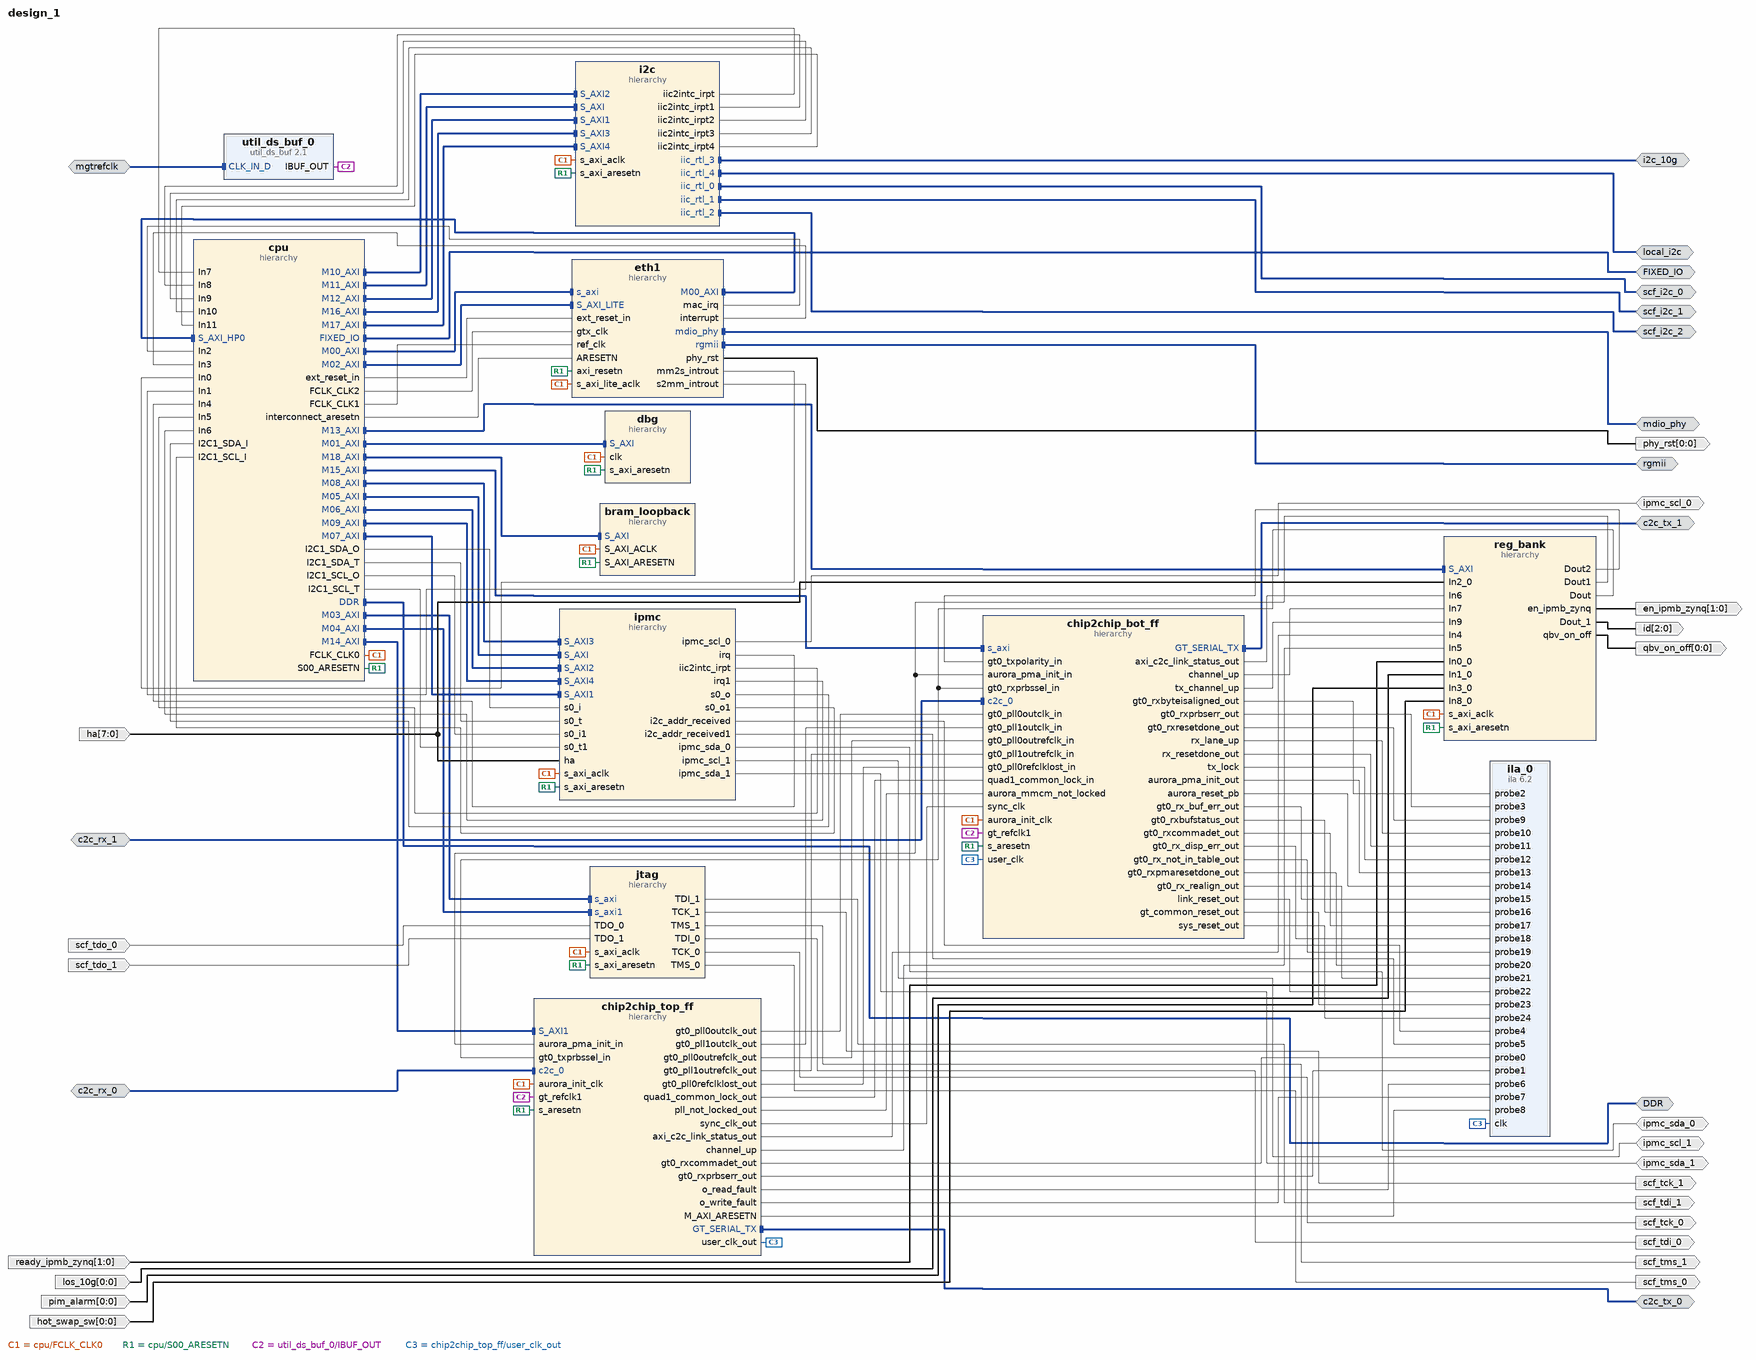
[diagram p0: block diagram of the top level]
# Vivado block design design_1, xc7z015clg485-1, Vivado 2020.1.1_AR73018
create_bd_design design_1

create_bd_intf_port -mode Master -vlnv xilinx.com:interface:ddrx_rtl:1.0 DDR
create_bd_intf_port -mode Master -vlnv xilinx.com:display_processing_system7:fixedio_rtl:1.0 FIXED_IO
create_bd_intf_port -mode Master -vlnv xilinx.com:interface:mdio_rtl:1.0 mdio_phy
create_bd_intf_port -mode Master -vlnv xilinx.com:interface:rgmii_rtl:1.0 rgmii
create_bd_intf_port -mode Master -vlnv xilinx.com:interface:iic_rtl:1.0 scf_i2c_0
create_bd_intf_port -mode Master -vlnv xilinx.com:interface:iic_rtl:1.0 scf_i2c_1
create_bd_intf_port -mode Master -vlnv xilinx.com:interface:iic_rtl:1.0 scf_i2c_2
create_bd_intf_port -mode Master -vlnv xilinx.com:display_aurora:GT_Serial_Transceiver_Pins_TX_rtl:1.0 c2c_tx_0
create_bd_intf_port -mode Slave -vlnv xilinx.com:display_aurora:GT_Serial_Transceiver_Pins_RX_rtl:1.0 c2c_rx_0
create_bd_intf_port -mode Slave -vlnv xilinx.com:interface:diff_clock_rtl:1.0 mgtrefclk
set_property -dict {CONFIG.FREQ_HZ 250000000} [get_bd_intf_ports mgtrefclk]
create_bd_intf_port -mode Master -vlnv xilinx.com:display_aurora:GT_Serial_Transceiver_Pins_TX_rtl:1.0 c2c_tx_1
create_bd_intf_port -mode Slave -vlnv xilinx.com:display_aurora:GT_Serial_Transceiver_Pins_RX_rtl:1.0 c2c_rx_1
create_bd_intf_port -mode Master -vlnv xilinx.com:interface:iic_rtl:1.0 i2c_10g
create_bd_intf_port -mode Master -vlnv xilinx.com:interface:iic_rtl:1.0 local_i2c
create_bd_port -dir O -from 0 -to 0 -type rst phy_rst
set_property -dict {CONFIG.POLARITY ACTIVE_LOW} [get_bd_ports phy_rst]
create_bd_port -dir O scf_tdi_1
create_bd_port -dir O scf_tms_1
create_bd_port -dir O scf_tck_1
create_bd_port -dir I scf_tdo_0
create_bd_port -dir O scf_tdi_0
create_bd_port -dir O scf_tms_0
create_bd_port -dir O scf_tck_0
create_bd_port -dir I scf_tdo_1
create_bd_port -dir IO ipmc_sda_0
create_bd_port -dir IO ipmc_scl_0
create_bd_port -dir IO ipmc_scl_1
create_bd_port -dir IO ipmc_sda_1
create_bd_port -dir O -from 1 -to 0 en_ipmb_zynq
create_bd_port -dir O -from 2 -to 0 id
create_bd_port -dir I -from 1 -to 0 ready_ipmb_zynq
create_bd_port -dir I -from 0 -to 0 los_10g
create_bd_port -dir I -from 7 -to 0 ha
create_bd_port -dir I -from 0 -to 0 pim_alarm
create_bd_port -dir O -from 0 -to 0 qbv_on_off
create_bd_port -dir I -from 0 -to 0 hot_swap_sw

create_bd_cell -type hier eth1
create_bd_cell -type hier jtag
create_bd_cell -type hier ipmc
create_bd_cell -type hier cpu
create_bd_cell -type hier dbg
create_bd_cell -type hier i2c
create_bd_cell -type hier reg_bank
create_bd_cell -type ip -vlnv xilinx.com:ip:util_ds_buf:2.1 util_ds_buf_0
set_property -dict {CONFIG.C_BUF_TYPE IBUFDSGTE} [get_bd_cells util_ds_buf_0]
create_bd_cell -type hier chip2chip_top_ff
create_bd_cell -type hier chip2chip_bot_ff
create_bd_cell -type ip -vlnv xilinx.com:ip:ila:6.2 ila_0
set_property -dict [list \
  CONFIG.C_ENABLE_ILA_AXI_MON false \
  CONFIG.C_MONITOR_TYPE Native \
  CONFIG.C_NUM_OF_PROBES 25 \
  CONFIG.C_PROBE4_WIDTH 7 \
  CONFIG.C_PROBE5_WIDTH 7 \
] [get_bd_cells ila_0]
create_bd_cell -type hier bram_loopback

# ---- hierarchy /eth1 ----
current_bd_instance /eth1
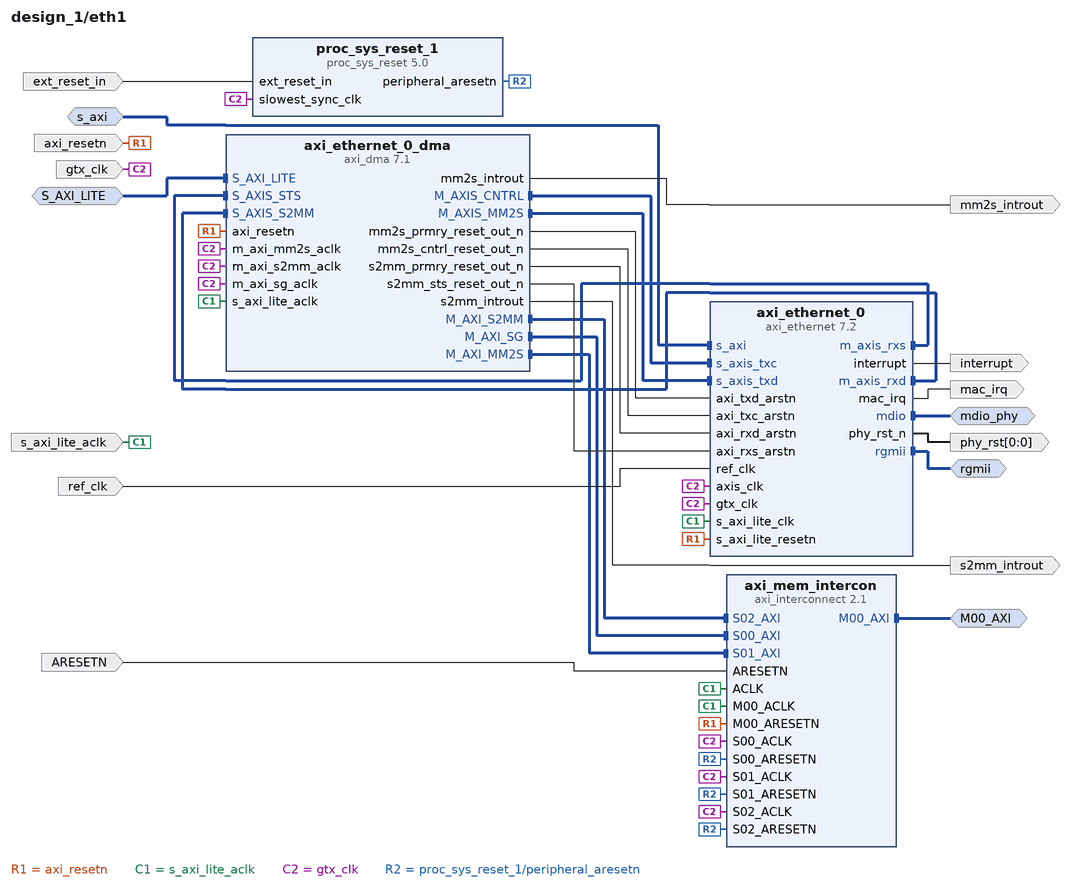
[diagram p1: block diagram inside /eth1]
create_bd_intf_pin -mode Slave -vlnv xilinx.com:interface:aximm_rtl:1.0 s_axi
create_bd_intf_pin -mode Master -vlnv xilinx.com:interface:mdio_rtl:1.0 mdio_phy
create_bd_intf_pin -mode Master -vlnv xilinx.com:interface:rgmii_rtl:1.0 rgmii
create_bd_intf_pin -mode Slave -vlnv xilinx.com:interface:aximm_rtl:1.0 S_AXI_LITE
create_bd_intf_pin -mode Master -vlnv xilinx.com:interface:aximm_rtl:1.0 M00_AXI
create_bd_pin -dir I -type rst axi_resetn
create_bd_pin -dir I -type clk s_axi_lite_aclk
create_bd_pin -dir O -type intr mac_irq
create_bd_pin -dir I -type clk gtx_clk
create_bd_pin -dir O -type intr interrupt
create_bd_pin -dir O -from 0 -to 0 -type rst phy_rst
create_bd_pin -dir I -type clk ref_clk
create_bd_pin -dir O -type intr mm2s_introut
create_bd_pin -dir O -type intr s2mm_introut
create_bd_pin -dir I -type rst ARESETN
create_bd_pin -dir I -type rst ext_reset_in

create_bd_cell -type ip -vlnv xilinx.com:ip:axi_ethernet:7.2 axi_ethernet_0
set_property -dict {CONFIG.PHY_TYPE RGMII} [get_bd_cells axi_ethernet_0]
create_bd_cell -type ip -vlnv xilinx.com:ip:axi_dma:7.1 axi_ethernet_0_dma
set_property -dict [list \
  CONFIG.c_include_mm2s_dre 1 \
  CONFIG.c_include_s2mm_dre 1 \
  CONFIG.c_sg_length_width 16 \
  CONFIG.c_sg_use_stsapp_length 1 \
] [get_bd_cells axi_ethernet_0_dma]
create_bd_cell -type ip -vlnv xilinx.com:ip:axi_interconnect:2.1 axi_mem_intercon
set_property -dict {CONFIG.NUM_MI 1 CONFIG.NUM_SI 3} [get_bd_cells axi_mem_intercon]
create_bd_cell -type ip -vlnv xilinx.com:ip:proc_sys_reset:5.0 proc_sys_reset_1

# ---- hierarchy /jtag ----
current_bd_instance /jtag
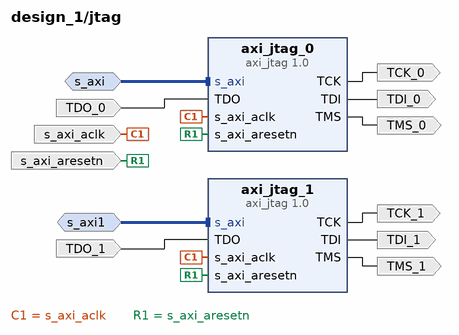
[diagram p2: block diagram inside /jtag]
create_bd_intf_pin -mode Slave -vlnv xilinx.com:interface:aximm_rtl:1.0 s_axi
create_bd_intf_pin -mode Slave -vlnv xilinx.com:interface:aximm_rtl:1.0 s_axi1
create_bd_pin -dir I -type clk s_axi_aclk
create_bd_pin -dir I -type rst s_axi_aresetn
create_bd_pin -dir O TCK_0
create_bd_pin -dir O TMS_0
create_bd_pin -dir O TDI_0
create_bd_pin -dir I TDO_0
create_bd_pin -dir O TCK_1
create_bd_pin -dir O TMS_1
create_bd_pin -dir O TDI_1
create_bd_pin -dir I TDO_1

create_bd_cell -type ip -vlnv A_Clark:Debug:axi_jtag:1.0 axi_jtag_0
create_bd_cell -type ip -vlnv A_Clark:Debug:axi_jtag:1.0 axi_jtag_1

# ---- hierarchy /ipmc ----
current_bd_instance /ipmc
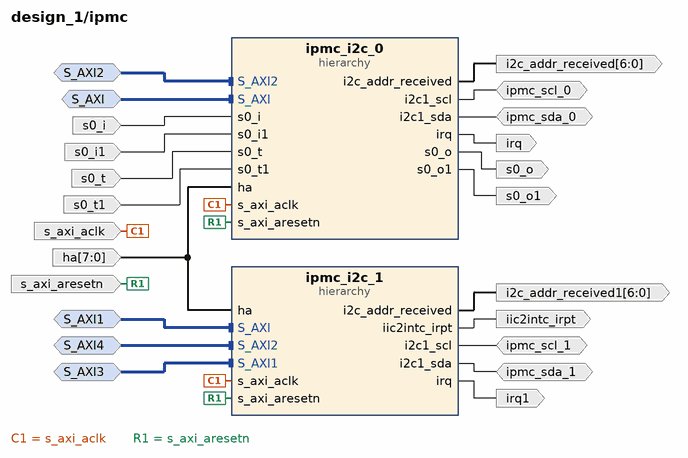
[diagram p3: block diagram inside /ipmc]
create_bd_intf_pin -mode Slave -vlnv xilinx.com:interface:aximm_rtl:1.0 S_AXI
create_bd_intf_pin -mode Slave -vlnv xilinx.com:interface:aximm_rtl:1.0 S_AXI2
create_bd_intf_pin -mode Slave -vlnv xilinx.com:interface:aximm_rtl:1.0 S_AXI1
create_bd_intf_pin -mode Slave -vlnv xilinx.com:interface:aximm_rtl:1.0 S_AXI3
create_bd_intf_pin -mode Slave -vlnv xilinx.com:interface:aximm_rtl:1.0 S_AXI4
create_bd_pin -dir IO ipmc_scl_0
create_bd_pin -dir IO ipmc_sda_0
create_bd_pin -dir O -type intr irq
create_bd_pin -dir I s0_i
create_bd_pin -dir I s0_i1
create_bd_pin -dir O s0_o
create_bd_pin -dir O s0_o1
create_bd_pin -dir I s0_t
create_bd_pin -dir I s0_t1
create_bd_pin -dir I -type clk s_axi_aclk
create_bd_pin -dir I -type rst s_axi_aresetn
create_bd_pin -dir IO ipmc_scl_1
create_bd_pin -dir IO ipmc_sda_1
create_bd_pin -dir O -type intr iic2intc_irpt
create_bd_pin -dir O -type intr irq1
create_bd_pin -dir O -from 6 -to 0 i2c_addr_received
create_bd_pin -dir O -from 6 -to 0 i2c_addr_received1
create_bd_pin -dir I -from 7 -to 0 ha

create_bd_cell -type hier ipmc_i2c_0
create_bd_cell -type hier ipmc_i2c_1

# ---- hierarchy /ipmc/ipmc_i2c_0 ----
current_bd_instance /ipmc/ipmc_i2c_0
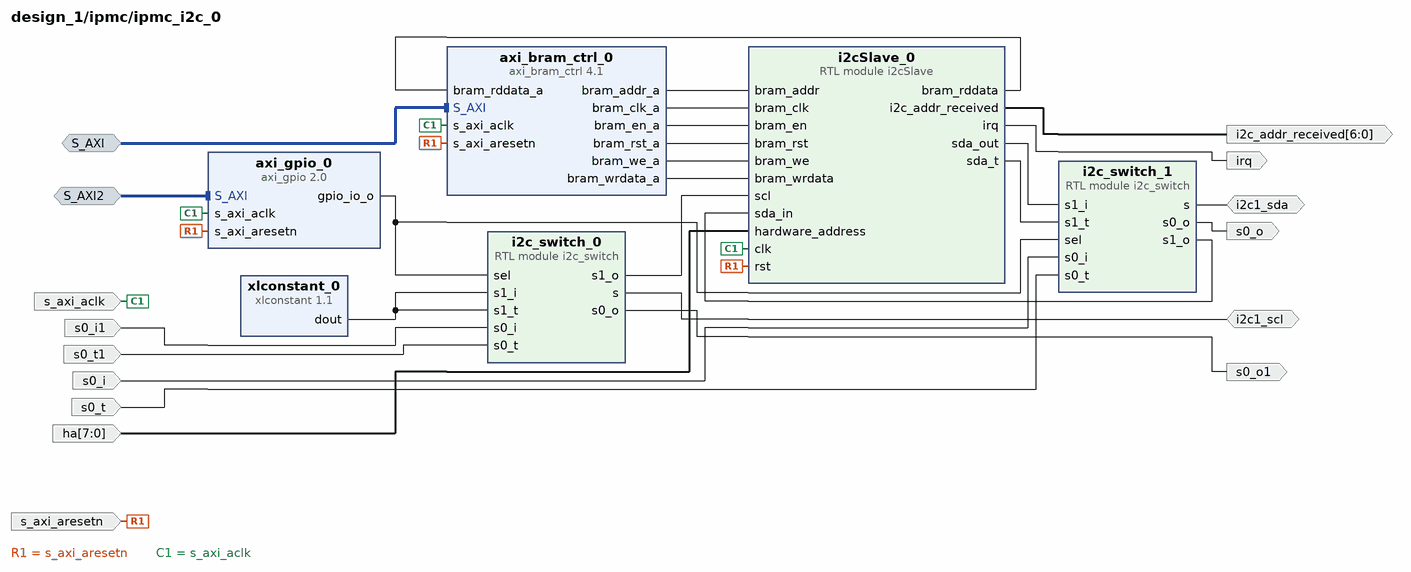
[diagram p4: block diagram inside /ipmc/ipmc_i2c_0]
create_bd_intf_pin -mode Slave -vlnv xilinx.com:interface:aximm_rtl:1.0 S_AXI
create_bd_intf_pin -mode Slave -vlnv xilinx.com:interface:aximm_rtl:1.0 S_AXI2
create_bd_pin -dir IO i2c1_scl
create_bd_pin -dir IO i2c1_sda
create_bd_pin -dir O -type intr irq
create_bd_pin -dir I s0_i
create_bd_pin -dir I s0_i1
create_bd_pin -dir O s0_o
create_bd_pin -dir O s0_o1
create_bd_pin -dir I s0_t
create_bd_pin -dir I s0_t1
create_bd_pin -dir I -type clk s_axi_aclk
create_bd_pin -dir I -type rst s_axi_aresetn
create_bd_pin -dir O -from 6 -to 0 i2c_addr_received
create_bd_pin -dir I -from 7 -to 0 ha

create_bd_cell -type ip -vlnv xilinx.com:ip:axi_bram_ctrl:4.1 axi_bram_ctrl_0
set_property -dict {CONFIG.SINGLE_PORT_BRAM 1} [get_bd_cells axi_bram_ctrl_0]
create_bd_cell -type ip -vlnv xilinx.com:ip:axi_gpio:2.0 axi_gpio_0
set_property -dict {CONFIG.C_GPIO_WIDTH 1} [get_bd_cells axi_gpio_0]
create_bd_cell -type module -reference i2c_switch i2c_switch_0
create_bd_cell -type module -reference i2c_switch i2c_switch_1
create_bd_cell -type ip -vlnv xilinx.com:ip:xlconstant:1.1 xlconstant_0
create_bd_cell -type module -reference i2cSlave i2cSlave_0

# ---- hierarchy /ipmc/ipmc_i2c_1 ----
current_bd_instance /ipmc/ipmc_i2c_1
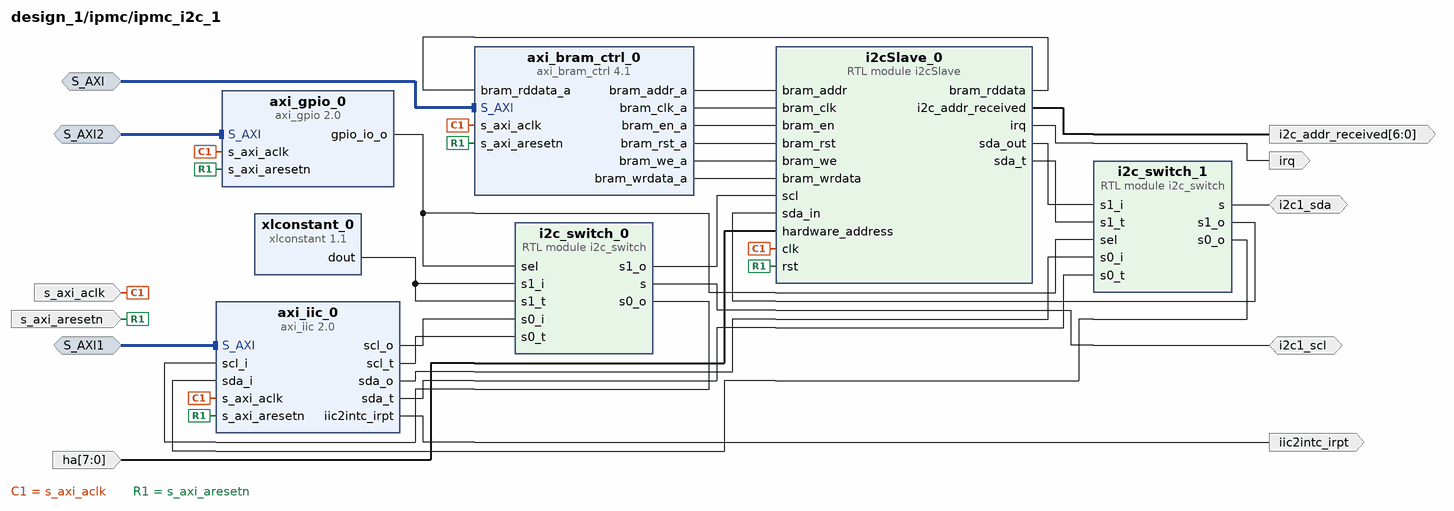
[diagram p5: block diagram inside /ipmc/ipmc_i2c_1]
create_bd_intf_pin -mode Slave -vlnv xilinx.com:interface:aximm_rtl:1.0 S_AXI
create_bd_intf_pin -mode Slave -vlnv xilinx.com:interface:aximm_rtl:1.0 S_AXI1
create_bd_intf_pin -mode Slave -vlnv xilinx.com:interface:aximm_rtl:1.0 S_AXI2
create_bd_pin -dir IO i2c1_scl
create_bd_pin -dir IO i2c1_sda
create_bd_pin -dir O -type intr iic2intc_irpt
create_bd_pin -dir O -type intr irq
create_bd_pin -dir I -type clk s_axi_aclk
create_bd_pin -dir I -type rst s_axi_aresetn
create_bd_pin -dir O -from 6 -to 0 i2c_addr_received
create_bd_pin -dir I -from 7 -to 0 ha

create_bd_cell -type ip -vlnv xilinx.com:ip:axi_bram_ctrl:4.1 axi_bram_ctrl_0
set_property -dict {CONFIG.SINGLE_PORT_BRAM 1} [get_bd_cells axi_bram_ctrl_0]
create_bd_cell -type ip -vlnv xilinx.com:ip:axi_gpio:2.0 axi_gpio_0
set_property -dict {CONFIG.C_GPIO_WIDTH 1} [get_bd_cells axi_gpio_0]
create_bd_cell -type ip -vlnv xilinx.com:ip:axi_iic:2.0 axi_iic_0
create_bd_cell -type module -reference i2c_switch i2c_switch_0
create_bd_cell -type module -reference i2c_switch i2c_switch_1
create_bd_cell -type ip -vlnv xilinx.com:ip:xlconstant:1.1 xlconstant_0
create_bd_cell -type module -reference i2cSlave i2cSlave_0

# ---- hierarchy /cpu ----
current_bd_instance /cpu
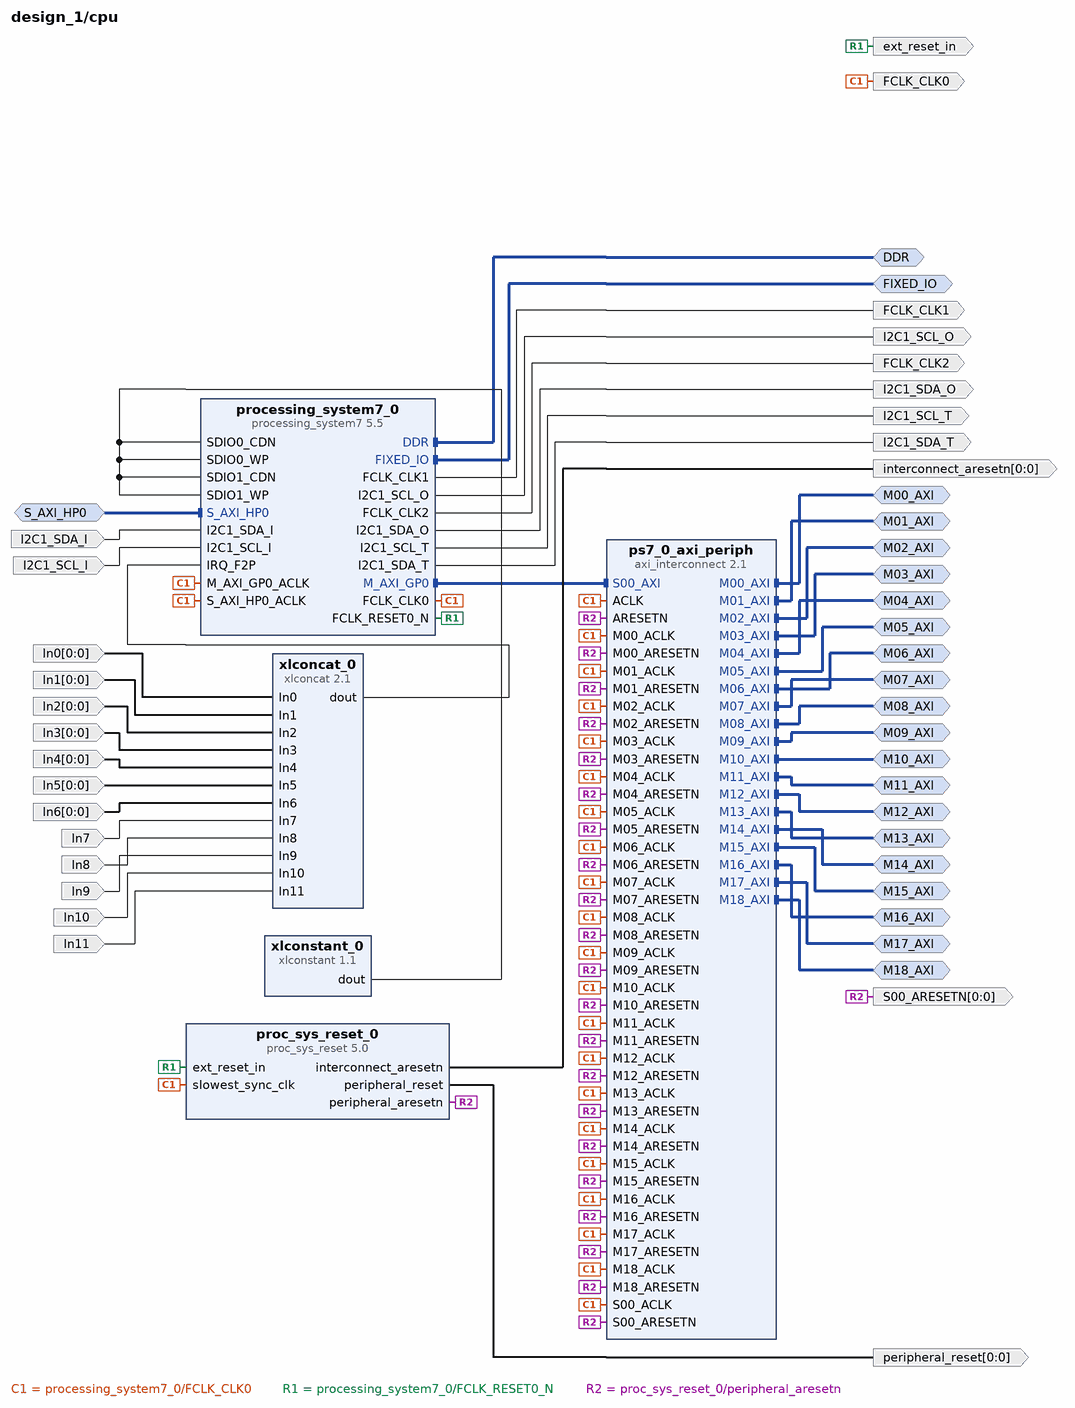
[diagram p6: block diagram inside /cpu]
create_bd_intf_pin -mode Master -vlnv xilinx.com:interface:ddrx_rtl:1.0 DDR
create_bd_intf_pin -mode Master -vlnv xilinx.com:display_processing_system7:fixedio_rtl:1.0 FIXED_IO
create_bd_intf_pin -mode Slave -vlnv xilinx.com:interface:aximm_rtl:1.0 S_AXI_HP0
create_bd_intf_pin -mode Master -vlnv xilinx.com:interface:aximm_rtl:1.0 M00_AXI
create_bd_intf_pin -mode Master -vlnv xilinx.com:interface:aximm_rtl:1.0 M01_AXI
create_bd_intf_pin -mode Master -vlnv xilinx.com:interface:aximm_rtl:1.0 M02_AXI
create_bd_intf_pin -mode Master -vlnv xilinx.com:interface:aximm_rtl:1.0 M03_AXI
create_bd_intf_pin -mode Master -vlnv xilinx.com:interface:aximm_rtl:1.0 M04_AXI
create_bd_intf_pin -mode Master -vlnv xilinx.com:interface:aximm_rtl:1.0 M05_AXI
create_bd_intf_pin -mode Master -vlnv xilinx.com:interface:aximm_rtl:1.0 M06_AXI
create_bd_intf_pin -mode Master -vlnv xilinx.com:interface:aximm_rtl:1.0 M07_AXI
create_bd_intf_pin -mode Master -vlnv xilinx.com:interface:aximm_rtl:1.0 M08_AXI
create_bd_intf_pin -mode Master -vlnv xilinx.com:interface:aximm_rtl:1.0 M09_AXI
create_bd_intf_pin -mode Master -vlnv xilinx.com:interface:aximm_rtl:1.0 M10_AXI
create_bd_intf_pin -mode Master -vlnv xilinx.com:interface:aximm_rtl:1.0 M11_AXI
create_bd_intf_pin -mode Master -vlnv xilinx.com:interface:aximm_rtl:1.0 M12_AXI
create_bd_intf_pin -mode Master -vlnv xilinx.com:interface:aximm_rtl:1.0 M13_AXI
create_bd_intf_pin -mode Master -vlnv xilinx.com:interface:aximm_rtl:1.0 M14_AXI
create_bd_intf_pin -mode Master -vlnv xilinx.com:interface:aximm_rtl:1.0 M15_AXI
create_bd_intf_pin -mode Master -vlnv xilinx.com:interface:aximm_rtl:1.0 M16_AXI
create_bd_intf_pin -mode Master -vlnv xilinx.com:interface:aximm_rtl:1.0 M17_AXI
create_bd_intf_pin -mode Master -vlnv xilinx.com:interface:aximm_rtl:1.0 M18_AXI
create_bd_pin -dir I I2C1_SDA_I
create_bd_pin -dir O I2C1_SDA_O
create_bd_pin -dir O I2C1_SDA_T
create_bd_pin -dir I I2C1_SCL_I
create_bd_pin -dir O I2C1_SCL_O
create_bd_pin -dir O I2C1_SCL_T
create_bd_pin -dir O -type clk FCLK_CLK0
create_bd_pin -dir O -type clk FCLK_CLK1
create_bd_pin -dir O -type clk FCLK_CLK2
create_bd_pin -dir O -type rst ext_reset_in
create_bd_pin -dir I -from 0 -to 0 In0
create_bd_pin -dir I -from 0 -to 0 In1
create_bd_pin -dir I -from 0 -to 0 In2
create_bd_pin -dir I -from 0 -to 0 In3
create_bd_pin -dir I -from 0 -to 0 In4
create_bd_pin -dir I -from 0 -to 0 In5
create_bd_pin -dir I -from 0 -to 0 In6
create_bd_pin -dir O -from 0 -to 0 -type rst interconnect_aresetn
create_bd_pin -dir O -from 0 -to 0 -type rst S00_ARESETN
create_bd_pin -dir O -from 0 -to 0 -type rst peripheral_reset
create_bd_pin -dir I -type intr In7
create_bd_pin -dir I -type intr In8
create_bd_pin -dir I -type intr In9
create_bd_pin -dir I -type intr In10
create_bd_pin -dir I -type intr In11

create_bd_cell -type ip -vlnv xilinx.com:ip:processing_system7:5.5 processing_system7_0
set_property -dict [list \
  CONFIG.PCW_APU_PERIPHERAL_FREQMHZ 666.666666 \
  CONFIG.PCW_CAN1_CAN1_IO {MIO 8 .. 9} \
  CONFIG.PCW_CAN1_PERIPHERAL_ENABLE 1 \
  CONFIG.PCW_ENET0_ENET0_IO {MIO 16 .. 27} \
  CONFIG.PCW_ENET0_GRP_MDIO_ENABLE 1 \
  CONFIG.PCW_ENET0_GRP_MDIO_IO {MIO 52 .. 53} \
  CONFIG.PCW_ENET0_PERIPHERAL_ENABLE 1 \
  CONFIG.PCW_ENET0_RESET_ENABLE 0 \
  CONFIG.PCW_ENET1_PERIPHERAL_CLKSRC External \
  CONFIG.PCW_ENET_RESET_ENABLE 1 \
  CONFIG.PCW_ENET_RESET_SELECT {Share reset pin} \
  CONFIG.PCW_EN_CLK1_PORT 1 \
  CONFIG.PCW_EN_CLK2_PORT 1 \
  CONFIG.PCW_FCLK_CLK0_BUF FALSE \
  CONFIG.PCW_FCLK_CLK1_BUF TRUE \
  CONFIG.PCW_FPGA0_PERIPHERAL_FREQMHZ 100 \
  CONFIG.PCW_FPGA1_PERIPHERAL_FREQMHZ 200 \
  CONFIG.PCW_FPGA2_PERIPHERAL_FREQMHZ 125 \
  CONFIG.PCW_FPGA_FCLK1_ENABLE 1 \
  CONFIG.PCW_FPGA_FCLK2_ENABLE 1 \
  CONFIG.PCW_GP0_EN_MODIFIABLE_TXN 0 \
  CONFIG.PCW_GP1_EN_MODIFIABLE_TXN 0 \
  CONFIG.PCW_GPIO_MIO_GPIO_ENABLE 1 \
  CONFIG.PCW_GPIO_MIO_GPIO_IO MIO \
  CONFIG.PCW_I2C0_GRP_INT_ENABLE 0 \
  CONFIG.PCW_I2C0_I2C0_IO {MIO 50 .. 51} \
  CONFIG.PCW_I2C0_PERIPHERAL_ENABLE 1 \
  CONFIG.PCW_I2C1_I2C1_IO EMIO \
  CONFIG.PCW_I2C1_PERIPHERAL_ENABLE 1 \
  CONFIG.PCW_I2C_PERIPHERAL_FREQMHZ 111.111115 \
  CONFIG.PCW_I2C_RESET_ENABLE 1 \
  CONFIG.PCW_I2C_RESET_SELECT {Share reset pin} \
  CONFIG.PCW_IRQ_F2P_INTR 1 \
  CONFIG.PCW_M_AXI_GP0_ENABLE_STATIC_REMAP 1 \
  CONFIG.PCW_M_AXI_GP0_FREQMHZ 62 \
  CONFIG.PCW_M_AXI_GP0_THREAD_ID_WIDTH 6 \
  CONFIG.PCW_PERIPHERAL_BOARD_PRESET None \
  CONFIG.PCW_PRESET_BANK1_VOLTAGE {LVCMOS 1.8V} \
  CONFIG.PCW_QSPI_GRP_SINGLE_SS_ENABLE 1 \
  CONFIG.PCW_QSPI_GRP_SINGLE_SS_IO {MIO 1 .. 6} \
  CONFIG.PCW_QSPI_PERIPHERAL_ENABLE 1 \
  CONFIG.PCW_QSPI_QSPI_IO {MIO 1 .. 6} \
  CONFIG.PCW_SD0_GRP_CD_ENABLE 1 \
  CONFIG.PCW_SD0_GRP_CD_IO EMIO \
  CONFIG.PCW_SD0_GRP_WP_ENABLE 1 \
  CONFIG.PCW_SD0_GRP_WP_IO EMIO \
  CONFIG.PCW_SD0_PERIPHERAL_ENABLE 1 \
  CONFIG.PCW_SD0_SD0_IO {MIO 40 .. 45} \
  CONFIG.PCW_SD1_GRP_CD_ENABLE 1 \
  CONFIG.PCW_SD1_GRP_CD_IO EMIO \
  CONFIG.PCW_SD1_GRP_WP_ENABLE 1 \
  CONFIG.PCW_SD1_GRP_WP_IO EMIO \
  CONFIG.PCW_SD1_PERIPHERAL_ENABLE 1 \
  CONFIG.PCW_SD1_SD1_IO {MIO 10 .. 15} \
  CONFIG.PCW_SDIO_PERIPHERAL_FREQMHZ 50 \
  CONFIG.PCW_SINGLE_QSPI_DATA_MODE x4 \
  CONFIG.PCW_S_AXI_HP0_FREQMHZ 62 \
  CONFIG.PCW_UART1_PERIPHERAL_ENABLE 1 \
  CONFIG.PCW_UART1_UART1_IO {MIO 48 .. 49} \
  CONFIG.PCW_UART_PERIPHERAL_FREQMHZ 100 \
  CONFIG.PCW_UIPARAM_DDR_FREQ_MHZ 533.333333 \
  CONFIG.PCW_UIPARAM_DDR_PARTNO {MT41J256M16 RE-125} \
  CONFIG.PCW_USB0_PERIPHERAL_ENABLE 1 \
  CONFIG.PCW_USB0_RESET_ENABLE 1 \
  CONFIG.PCW_USB0_RESET_IO {MIO 7} \
  CONFIG.PCW_USB0_USB0_IO {MIO 28 .. 39} \
  CONFIG.PCW_USB_RESET_ENABLE 1 \
  CONFIG.PCW_USB_RESET_SELECT {Share reset pin} \
  CONFIG.PCW_USE_FABRIC_INTERRUPT 1 \
  CONFIG.PCW_USE_S_AXI_HP0 1 \
] [get_bd_cells processing_system7_0]
# 516 more settings of processing_system7_0 are not shown: defaults, MIO pin electricals, DDR timing, and values the tool derives
create_bd_cell -type ip -vlnv xilinx.com:ip:xlconcat:2.1 xlconcat_0
set_property -dict {CONFIG.NUM_PORTS 12} [get_bd_cells xlconcat_0]
create_bd_cell -type ip -vlnv xilinx.com:ip:xlconstant:1.1 xlconstant_0
set_property -dict {CONFIG.CONST_VAL 0} [get_bd_cells xlconstant_0]
create_bd_cell -type ip -vlnv xilinx.com:ip:proc_sys_reset:5.0 proc_sys_reset_0
create_bd_cell -type ip -vlnv xilinx.com:ip:axi_interconnect:2.1 ps7_0_axi_periph
set_property -dict [list \
  CONFIG.ENABLE_ADVANCED_OPTIONS 1 \
  CONFIG.M00_HAS_REGSLICE 4 \
  CONFIG.M01_HAS_REGSLICE 4 \
  CONFIG.M02_HAS_REGSLICE 4 \
  CONFIG.M03_HAS_REGSLICE 4 \
  CONFIG.NUM_MI 19 \
  CONFIG.S00_HAS_DATA_FIFO 2 \
  CONFIG.S00_HAS_REGSLICE 4 \
  CONFIG.STRATEGY 2 \
] [get_bd_cells ps7_0_axi_periph]

# ---- hierarchy /dbg ----
current_bd_instance /dbg
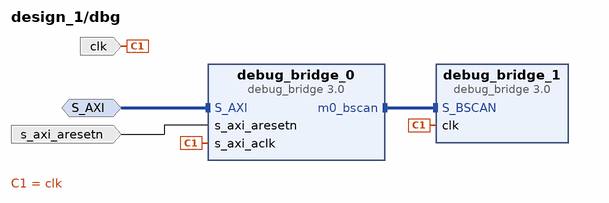
[diagram p7: block diagram inside /dbg]
create_bd_intf_pin -mode Slave -vlnv xilinx.com:interface:aximm_rtl:1.0 S_AXI
create_bd_pin -dir I -type clk clk
create_bd_pin -dir I -type rst s_axi_aresetn

create_bd_cell -type ip -vlnv xilinx.com:ip:debug_bridge:3.0 debug_bridge_0
set_property -dict [list \
  CONFIG.C_BSCAN_MUX 1 \
  CONFIG.C_DEBUG_MODE 2 \
  CONFIG.C_NUM_BS_MASTER 1 \
  CONFIG.C_XVC_HW_ID 0x0001 \
] [get_bd_cells debug_bridge_0]
create_bd_cell -type ip -vlnv xilinx.com:ip:debug_bridge:3.0 debug_bridge_1

# ---- hierarchy /i2c ----
current_bd_instance /i2c
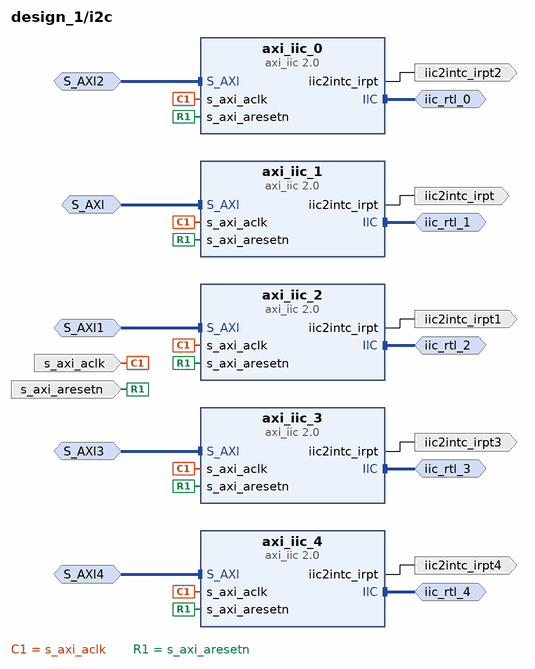
[diagram p8: block diagram inside /i2c]
create_bd_intf_pin -mode Slave -vlnv xilinx.com:interface:aximm_rtl:1.0 S_AXI
create_bd_intf_pin -mode Master -vlnv xilinx.com:interface:iic_rtl:1.0 iic_rtl_1
create_bd_intf_pin -mode Slave -vlnv xilinx.com:interface:aximm_rtl:1.0 S_AXI1
create_bd_intf_pin -mode Master -vlnv xilinx.com:interface:iic_rtl:1.0 iic_rtl_2
create_bd_intf_pin -mode Slave -vlnv xilinx.com:interface:aximm_rtl:1.0 S_AXI2
create_bd_intf_pin -mode Master -vlnv xilinx.com:interface:iic_rtl:1.0 iic_rtl_0
create_bd_intf_pin -mode Master -vlnv xilinx.com:interface:iic_rtl:1.0 iic_rtl_3
create_bd_intf_pin -mode Slave -vlnv xilinx.com:interface:aximm_rtl:1.0 S_AXI3
create_bd_intf_pin -mode Master -vlnv xilinx.com:interface:iic_rtl:1.0 iic_rtl_4
create_bd_intf_pin -mode Slave -vlnv xilinx.com:interface:aximm_rtl:1.0 S_AXI4
create_bd_pin -dir I -type clk s_axi_aclk
create_bd_pin -dir I -type rst s_axi_aresetn
create_bd_pin -dir O -type intr iic2intc_irpt
create_bd_pin -dir O -type intr iic2intc_irpt1
create_bd_pin -dir O -type intr iic2intc_irpt2
create_bd_pin -dir O -type intr iic2intc_irpt3
create_bd_pin -dir O -type intr iic2intc_irpt4

create_bd_cell -type ip -vlnv xilinx.com:ip:axi_iic:2.0 axi_iic_1
set_property -dict {CONFIG.C_SCL_INERTIAL_DELAY 10 CONFIG.C_SDA_INERTIAL_DELAY 10} [get_bd_cells axi_iic_1]
create_bd_cell -type ip -vlnv xilinx.com:ip:axi_iic:2.0 axi_iic_2
set_property -dict {CONFIG.C_SCL_INERTIAL_DELAY 10 CONFIG.C_SDA_INERTIAL_DELAY 10} [get_bd_cells axi_iic_2]
create_bd_cell -type ip -vlnv xilinx.com:ip:axi_iic:2.0 axi_iic_0
set_property -dict {CONFIG.C_SCL_INERTIAL_DELAY 10 CONFIG.C_SDA_INERTIAL_DELAY 10} [get_bd_cells axi_iic_0]
create_bd_cell -type ip -vlnv xilinx.com:ip:axi_iic:2.0 axi_iic_3
set_property -dict {CONFIG.C_SCL_INERTIAL_DELAY 10 CONFIG.C_SDA_INERTIAL_DELAY 10} [get_bd_cells axi_iic_3]
create_bd_cell -type ip -vlnv xilinx.com:ip:axi_iic:2.0 axi_iic_4
set_property -dict {CONFIG.C_SCL_INERTIAL_DELAY 10 CONFIG.C_SDA_INERTIAL_DELAY 10} [get_bd_cells axi_iic_4]

# ---- hierarchy /reg_bank ----
current_bd_instance /reg_bank
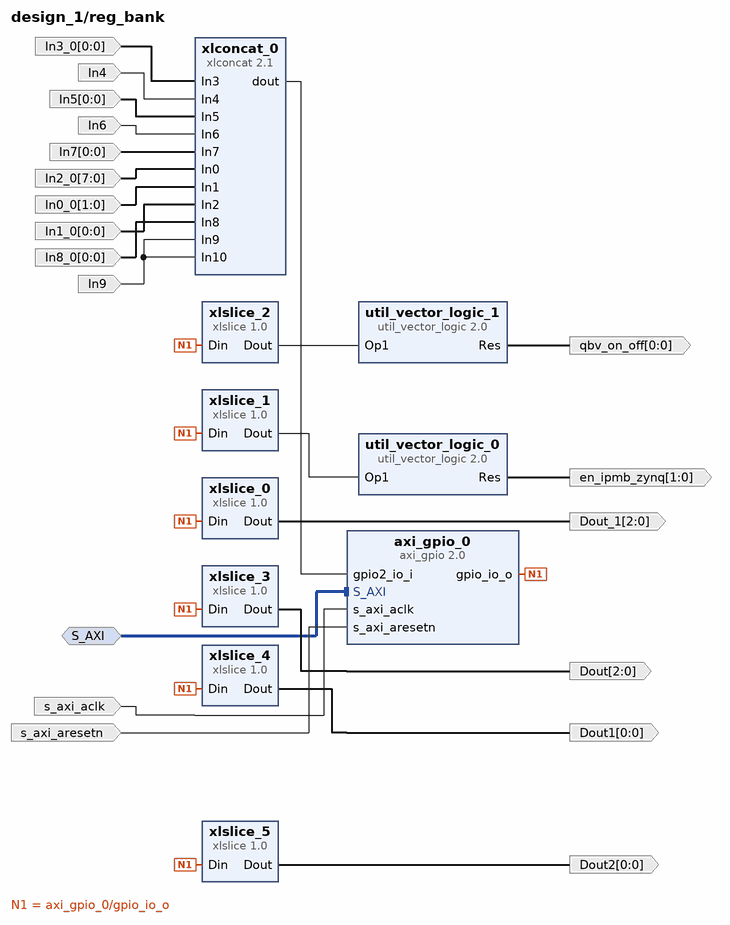
[diagram p9: block diagram inside /reg_bank]
create_bd_intf_pin -mode Slave -vlnv xilinx.com:interface:aximm_rtl:1.0 S_AXI
create_bd_pin -dir O -from 2 -to 0 Dout_1
create_bd_pin -dir I -from 1 -to 0 In0_0
create_bd_pin -dir I -from 0 -to 0 In1_0
create_bd_pin -dir I -from 7 -to 0 In2_0
create_bd_pin -dir I -from 0 -to 0 In3_0
create_bd_pin -dir I -type clk s_axi_aclk
create_bd_pin -dir I -type rst s_axi_aresetn
create_bd_pin -dir I In4
create_bd_pin -dir I -from 0 -to 0 In5
create_bd_pin -dir I In6
create_bd_pin -dir I -from 0 -to 0 In7
create_bd_pin -dir O -from 2 -to 0 Dout
create_bd_pin -dir O -from 0 -to 0 Dout1
create_bd_pin -dir I -from 0 -to 0 In8_0
create_bd_pin -dir O -from 1 -to 0 en_ipmb_zynq
create_bd_pin -dir O -from 0 -to 0 qbv_on_off
create_bd_pin -dir I In9
create_bd_pin -dir O -from 0 -to 0 Dout2

create_bd_cell -type ip -vlnv xilinx.com:ip:xlslice:1.0 xlslice_0
set_property -dict {CONFIG.DIN_FROM 4 CONFIG.DIN_TO 2 CONFIG.DIN_WIDTH 10 CONFIG.DOUT_WIDTH 3} [get_bd_cells xlslice_0]
create_bd_cell -type ip -vlnv xilinx.com:ip:xlconcat:2.1 xlconcat_0
set_property -dict {CONFIG.NUM_PORTS 11} [get_bd_cells xlconcat_0]
create_bd_cell -type ip -vlnv xilinx.com:ip:axi_gpio:2.0 axi_gpio_0
set_property -dict [list \
  CONFIG.C_ALL_INPUTS_2 1 \
  CONFIG.C_ALL_OUTPUTS 1 \
  CONFIG.C_DOUT_DEFAULT 0x00000000 \
  CONFIG.C_GPIO2_WIDTH 19 \
  CONFIG.C_GPIO_WIDTH 11 \
  CONFIG.C_IS_DUAL 1 \
] [get_bd_cells axi_gpio_0]
create_bd_cell -type ip -vlnv xilinx.com:ip:xlslice:1.0 xlslice_1
set_property -dict {CONFIG.DIN_FROM 1 CONFIG.DIN_TO 0 CONFIG.DIN_WIDTH 10 CONFIG.DOUT_WIDTH 2} [get_bd_cells xlslice_1]
create_bd_cell -type ip -vlnv xilinx.com:ip:xlslice:1.0 xlslice_2
set_property -dict {CONFIG.DIN_FROM 5 CONFIG.DIN_TO 5 CONFIG.DIN_WIDTH 10 CONFIG.DOUT_WIDTH 1} [get_bd_cells xlslice_2]
create_bd_cell -type ip -vlnv xilinx.com:ip:xlslice:1.0 xlslice_4
set_property -dict {CONFIG.DIN_FROM 9 CONFIG.DIN_TO 9 CONFIG.DIN_WIDTH 10 CONFIG.DOUT_WIDTH 1} [get_bd_cells xlslice_4]
create_bd_cell -type ip -vlnv xilinx.com:ip:xlslice:1.0 xlslice_3
set_property -dict {CONFIG.DIN_FROM 8 CONFIG.DIN_TO 6 CONFIG.DIN_WIDTH 10 CONFIG.DOUT_WIDTH 3} [get_bd_cells xlslice_3]
create_bd_cell -type ip -vlnv xilinx.com:ip:util_vector_logic:2.0 util_vector_logic_0
set_property -dict {CONFIG.C_OPERATION not CONFIG.C_SIZE 2} [get_bd_cells util_vector_logic_0]
create_bd_cell -type ip -vlnv xilinx.com:ip:util_vector_logic:2.0 util_vector_logic_1
set_property -dict {CONFIG.C_OPERATION not CONFIG.C_SIZE 1} [get_bd_cells util_vector_logic_1]
create_bd_cell -type ip -vlnv xilinx.com:ip:xlslice:1.0 xlslice_5
set_property -dict {CONFIG.DIN_FROM 10 CONFIG.DIN_TO 10 CONFIG.DIN_WIDTH 11 CONFIG.DOUT_WIDTH 1} [get_bd_cells xlslice_5]

# ---- hierarchy /chip2chip_top_ff ----
current_bd_instance /chip2chip_top_ff
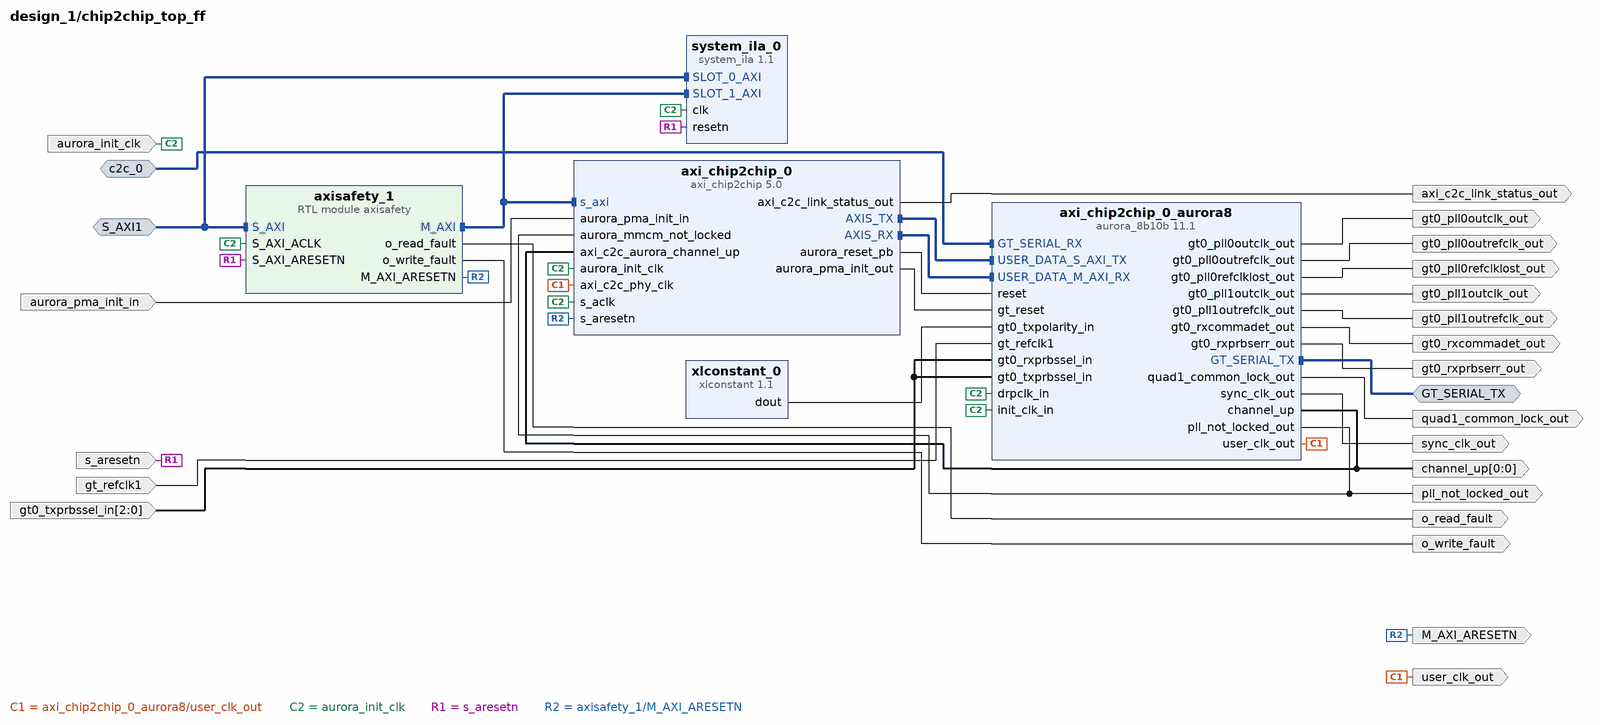
[diagram p10: block diagram inside /chip2chip_top_ff]
create_bd_intf_pin -mode Master -vlnv xilinx.com:display_aurora:GT_Serial_Transceiver_Pins_TX_rtl:1.0 GT_SERIAL_TX
create_bd_intf_pin -mode Slave -vlnv xilinx.com:display_aurora:GT_Serial_Transceiver_Pins_RX_rtl:1.0 c2c_0
create_bd_intf_pin -mode Slave -vlnv xilinx.com:interface:aximm_rtl:1.0 S_AXI1
create_bd_pin -dir I -type clk aurora_init_clk
create_bd_pin -dir I -type clk gt_refclk1
create_bd_pin -dir I -type rst s_aresetn
create_bd_pin -dir I -type rst aurora_pma_init_in
create_bd_pin -dir O gt0_pll0outclk_out
create_bd_pin -dir O gt0_pll1outclk_out
create_bd_pin -dir O gt0_pll0outrefclk_out
create_bd_pin -dir O gt0_pll1outrefclk_out
create_bd_pin -dir O gt0_pll0refclklost_out
create_bd_pin -dir O quad1_common_lock_out
create_bd_pin -dir O -type clk user_clk_out
create_bd_pin -dir O -type rst pll_not_locked_out
create_bd_pin -dir O -type clk sync_clk_out
create_bd_pin -dir O axi_c2c_link_status_out
create_bd_pin -dir O -from 0 -to 0 channel_up
create_bd_pin -dir I -from 2 -to 0 gt0_txprbssel_in
create_bd_pin -dir O gt0_rxprbserr_out
create_bd_pin -dir O gt0_rxcommadet_out
create_bd_pin -dir O o_read_fault
create_bd_pin -dir O o_write_fault
create_bd_pin -dir O -type rst M_AXI_ARESETN

create_bd_cell -type ip -vlnv xilinx.com:ip:aurora_8b10b:11.1 axi_chip2chip_0_aurora8
set_property -dict [list \
  CONFIG.C_AURORA_LANES 1 \
  CONFIG.C_DRP_IF false \
  CONFIG.C_GT_LOC_3 X \
  CONFIG.C_GT_LOC_4 X \
  CONFIG.C_LANE_WIDTH 4 \
  CONFIG.C_LINE_RATE 3.75 \
  CONFIG.C_REFCLK_FREQUENCY 250.000 \
  CONFIG.Interface_Mode Streaming \
  CONFIG.SINGLEEND_GTREFCLK true \
  CONFIG.SINGLEEND_INITCLK true \
  CONFIG.SupportLevel 1 \
  CONFIG.TransceiverControl true \
] [get_bd_cells axi_chip2chip_0_aurora8]
create_bd_cell -type ip -vlnv xilinx.com:ip:axi_chip2chip:5.0 axi_chip2chip_0
set_property -dict [list \
  CONFIG.C_ECC_ENABLE false \
  CONFIG.C_INCLUDE_AXILITE 0 \
  CONFIG.C_INTERFACE_MODE 1 \
  CONFIG.C_INTERFACE_TYPE 3 \
] [get_bd_cells axi_chip2chip_0]
create_bd_cell -type ip -vlnv xilinx.com:ip:xlconstant:1.1 xlconstant_0
create_bd_cell -type module -reference axisafety axisafety_1
set_property -dict [list \
  CONFIG.C_S_AXI_ADDR_WIDTH 27 \
  CONFIG.C_S_AXI_ID_WIDTH 6 \
  CONFIG.OPT_SELF_RESET 1 \
  CONFIG.OPT_TIMEOUT 10000 \
] [get_bd_cells axisafety_1]
create_bd_cell -type ip -vlnv xilinx.com:ip:system_ila:1.1 system_ila_0
set_property -dict {CONFIG.C_NUM_MONITOR_SLOTS 2} [get_bd_cells system_ila_0]

# ---- hierarchy /chip2chip_bot_ff ----
current_bd_instance /chip2chip_bot_ff
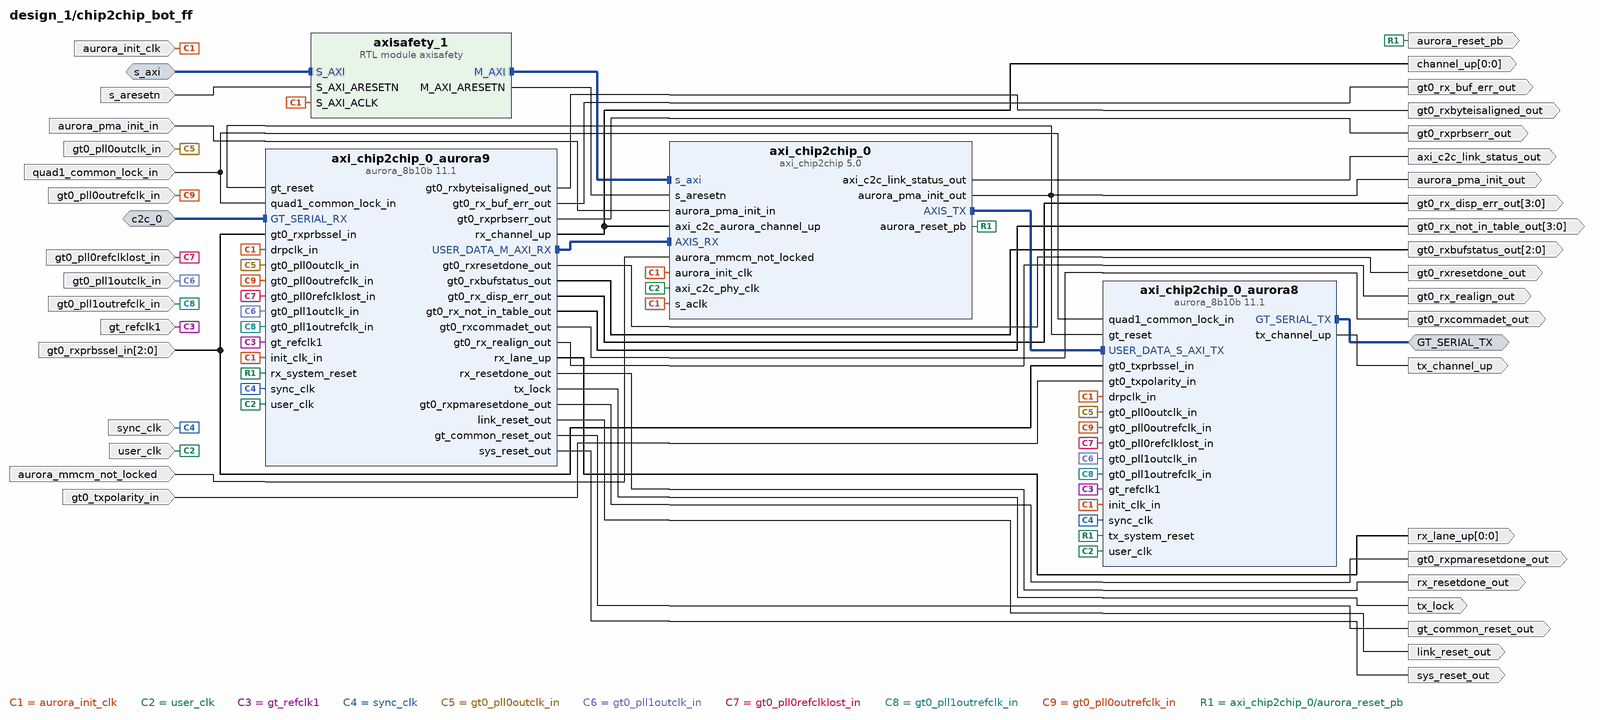
[diagram p11: block diagram inside /chip2chip_bot_ff]
create_bd_intf_pin -mode Master -vlnv xilinx.com:display_aurora:GT_Serial_Transceiver_Pins_TX_rtl:1.0 GT_SERIAL_TX
create_bd_intf_pin -mode Slave -vlnv xilinx.com:display_aurora:GT_Serial_Transceiver_Pins_RX_rtl:1.0 c2c_0
create_bd_intf_pin -mode Slave -vlnv xilinx.com:interface:aximm_rtl:1.0 s_axi
create_bd_pin -dir I -type clk aurora_init_clk
create_bd_pin -dir I -type clk gt_refclk1
create_bd_pin -dir I -type rst s_aresetn
create_bd_pin -dir I -type rst aurora_pma_init_in
create_bd_pin -dir I gt0_pll0outclk_in
create_bd_pin -dir I gt0_pll1outclk_in
create_bd_pin -dir I gt0_pll0outrefclk_in
create_bd_pin -dir I gt0_pll1outrefclk_in
create_bd_pin -dir I gt0_pll0refclklost_in
create_bd_pin -dir I quad1_common_lock_in
create_bd_pin -dir I -type clk user_clk
create_bd_pin -dir I -type rst aurora_mmcm_not_locked
create_bd_pin -dir I -type clk sync_clk
create_bd_pin -dir O axi_c2c_link_status_out
create_bd_pin -dir O -from 0 -to 0 channel_up
create_bd_pin -dir I -from 2 -to 0 gt0_rxprbssel_in
create_bd_pin -dir O tx_channel_up
create_bd_pin -dir I gt0_txpolarity_in
create_bd_pin -dir O gt0_rxbyteisaligned_out
create_bd_pin -dir O gt0_rxprbserr_out
create_bd_pin -dir O gt0_rxresetdone_out
create_bd_pin -dir O -from 0 -to 0 rx_lane_up
create_bd_pin -dir O rx_resetdone_out
create_bd_pin -dir O tx_lock
create_bd_pin -dir O -type rst aurora_pma_init_out
create_bd_pin -dir O -type rst aurora_reset_pb
create_bd_pin -dir O gt0_rx_buf_err_out
create_bd_pin -dir O -from 2 -to 0 gt0_rxbufstatus_out
create_bd_pin -dir O gt0_rxcommadet_out
create_bd_pin -dir O -from 3 -to 0 gt0_rx_disp_err_out
create_bd_pin -dir O -from 3 -to 0 gt0_rx_not_in_table_out
create_bd_pin -dir O gt0_rxpmaresetdone_out
create_bd_pin -dir O gt0_rx_realign_out
create_bd_pin -dir O -type rst link_reset_out
create_bd_pin -dir O gt_common_reset_out
create_bd_pin -dir O -type rst sys_reset_out

create_bd_cell -type ip -vlnv xilinx.com:ip:aurora_8b10b:11.1 axi_chip2chip_0_aurora8
set_property -dict [list \
  CONFIG.Backchannel_mode Timer \
  CONFIG.C_AURORA_LANES 1 \
  CONFIG.C_DRP_IF false \
  CONFIG.C_GT_CLOCK_1 GTPQ0 \
  CONFIG.C_GT_LOC_1 X \
  CONFIG.C_GT_LOC_2 1 \
  CONFIG.C_GT_LOC_3 X \
  CONFIG.C_GT_LOC_4 X \
  CONFIG.C_LANE_WIDTH 4 \
  CONFIG.C_LINE_RATE 3.75 \
  CONFIG.C_REFCLK_FREQUENCY 250.000 \
  CONFIG.Dataflow_Config TX-only_Simplex \
  CONFIG.Interface_Mode Streaming \
  CONFIG.SupportLevel 0 \
  CONFIG.TransceiverControl true \
] [get_bd_cells axi_chip2chip_0_aurora8]
create_bd_cell -type ip -vlnv xilinx.com:ip:axi_chip2chip:5.0 axi_chip2chip_0
set_property -dict [list \
  CONFIG.C_ECC_ENABLE false \
  CONFIG.C_INCLUDE_AXILITE 0 \
  CONFIG.C_INTERFACE_MODE 1 \
  CONFIG.C_INTERFACE_TYPE 3 \
] [get_bd_cells axi_chip2chip_0]
create_bd_cell -type module -reference axisafety axisafety_1
set_property -dict [list \
  CONFIG.C_S_AXI_ADDR_WIDTH 27 \
  CONFIG.C_S_AXI_ID_WIDTH 6 \
  CONFIG.OPT_SELF_RESET 1 \
  CONFIG.OPT_TIMEOUT 10000 \
] [get_bd_cells axisafety_1]
create_bd_cell -type ip -vlnv xilinx.com:ip:aurora_8b10b:11.1 axi_chip2chip_0_aurora9
set_property -dict [list \
  CONFIG.Backchannel_mode Timer \
  CONFIG.C_AURORA_LANES 1 \
  CONFIG.C_DRP_IF false \
  CONFIG.C_GT_CLOCK_1 GTPQ0 \
  CONFIG.C_GT_LOC_1 X \
  CONFIG.C_GT_LOC_2 1 \
  CONFIG.C_GT_LOC_3 X \
  CONFIG.C_GT_LOC_4 X \
  CONFIG.C_LANE_WIDTH 4 \
  CONFIG.C_LINE_RATE 3.75 \
  CONFIG.C_REFCLK_FREQUENCY 250.000 \
  CONFIG.Dataflow_Config RX-only_Simplex \
  CONFIG.Interface_Mode Streaming \
  CONFIG.SupportLevel 0 \
  CONFIG.TransceiverControl true \
] [get_bd_cells axi_chip2chip_0_aurora9]

# ---- hierarchy /bram_loopback ----
current_bd_instance /bram_loopback
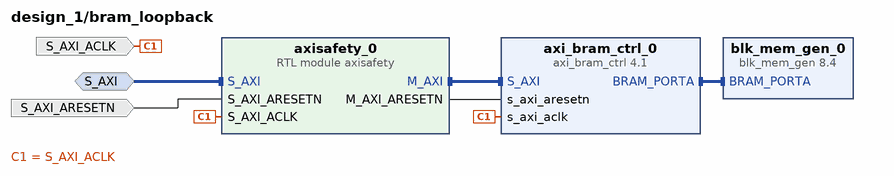
[diagram p12: block diagram inside /bram_loopback]
create_bd_intf_pin -mode Slave -vlnv xilinx.com:interface:aximm_rtl:1.0 S_AXI
create_bd_pin -dir I -type clk S_AXI_ACLK
create_bd_pin -dir I -type rst S_AXI_ARESETN

create_bd_cell -type ip -vlnv xilinx.com:ip:axi_bram_ctrl:4.1 axi_bram_ctrl_0
set_property -dict {CONFIG.SINGLE_PORT_BRAM 1} [get_bd_cells axi_bram_ctrl_0]
create_bd_cell -type module -reference axisafety axisafety_0
set_property -dict [list \
  CONFIG.C_S_AXI_ADDR_WIDTH 13 \
  CONFIG.C_S_AXI_ID_WIDTH 6 \
  CONFIG.OPT_SELF_RESET 1 \
  CONFIG.OPT_TIMEOUT 512 \
] [get_bd_cells axisafety_0]
create_bd_cell -type ip -vlnv xilinx.com:ip:blk_mem_gen:8.4 blk_mem_gen_0

# ---- connections ----

current_bd_instance /eth1
connect_bd_intf_net [get_bd_intf_pins mdio_phy] [get_bd_intf_pins axi_ethernet_0/mdio]
connect_bd_intf_net [get_bd_intf_pins axi_ethernet_0_dma/M_AXIS_CNTRL] [get_bd_intf_pins axi_ethernet_0/s_axis_txc]
connect_bd_intf_net [get_bd_intf_pins s_axi] [get_bd_intf_pins axi_ethernet_0/s_axi]
connect_bd_intf_net [get_bd_intf_pins axi_ethernet_0_dma/S_AXIS_STS] [get_bd_intf_pins axi_ethernet_0/m_axis_rxs]
connect_bd_intf_net [get_bd_intf_pins M00_AXI] [get_bd_intf_pins axi_mem_intercon/M00_AXI]
connect_bd_intf_net [get_bd_intf_pins rgmii] [get_bd_intf_pins axi_ethernet_0/rgmii]
connect_bd_intf_net [get_bd_intf_pins axi_ethernet_0_dma/S_AXIS_S2MM] [get_bd_intf_pins axi_ethernet_0/m_axis_rxd]
connect_bd_intf_net [get_bd_intf_pins S_AXI_LITE] [get_bd_intf_pins axi_ethernet_0_dma/S_AXI_LITE]
connect_bd_intf_net [get_bd_intf_pins axi_ethernet_0_dma/M_AXI_S2MM] [get_bd_intf_pins axi_mem_intercon/S02_AXI]
connect_bd_intf_net [get_bd_intf_pins axi_ethernet_0_dma/M_AXI_SG] [get_bd_intf_pins axi_mem_intercon/S00_AXI]
connect_bd_intf_net [get_bd_intf_pins axi_ethernet_0_dma/M_AXI_MM2S] [get_bd_intf_pins axi_mem_intercon/S01_AXI]
connect_bd_intf_net [get_bd_intf_pins axi_ethernet_0_dma/M_AXIS_MM2S] [get_bd_intf_pins axi_ethernet_0/s_axis_txd]
connect_bd_net [get_bd_pins axi_ethernet_0_dma/mm2s_prmry_reset_out_n] [get_bd_pins axi_ethernet_0/axi_txd_arstn]
connect_bd_net [get_bd_pins axi_ethernet_0_dma/mm2s_cntrl_reset_out_n] [get_bd_pins axi_ethernet_0/axi_txc_arstn]
connect_bd_net [get_bd_pins axi_ethernet_0_dma/s2mm_prmry_reset_out_n] [get_bd_pins axi_ethernet_0/axi_rxd_arstn]
connect_bd_net [get_bd_pins axi_ethernet_0_dma/s2mm_sts_reset_out_n] [get_bd_pins axi_ethernet_0/axi_rxs_arstn]
connect_bd_net -net proc_sys_reset_0_peripheral_aresetn [get_bd_pins axi_resetn] \
  [get_bd_pins axi_ethernet_0_dma/axi_resetn] [get_bd_pins axi_mem_intercon/M00_ARESETN] \
  [get_bd_pins axi_ethernet_0/s_axi_lite_resetn]
connect_bd_net [get_bd_pins s_axi_lite_aclk] \
  [get_bd_pins axi_ethernet_0_dma/s_axi_lite_aclk] [get_bd_pins axi_mem_intercon/ACLK] \
  [get_bd_pins axi_mem_intercon/M00_ACLK] [get_bd_pins axi_ethernet_0/s_axi_lite_clk]
connect_bd_net [get_bd_pins axi_ethernet_0/mac_irq] [get_bd_pins mac_irq]
connect_bd_net -net processing_system7_0_FCLK_CLK2 [get_bd_pins gtx_clk] \
  [get_bd_pins axi_ethernet_0/gtx_clk] [get_bd_pins axi_ethernet_0_dma/m_axi_sg_aclk] \
  [get_bd_pins axi_ethernet_0_dma/m_axi_mm2s_aclk] [get_bd_pins axi_ethernet_0_dma/m_axi_s2mm_aclk] \
  [get_bd_pins axi_mem_intercon/S00_ACLK] [get_bd_pins axi_mem_intercon/S01_ACLK] [get_bd_pins axi_mem_intercon/S02_ACLK] \
  [get_bd_pins axi_ethernet_0/axis_clk] [get_bd_pins proc_sys_reset_1/slowest_sync_clk]
connect_bd_net [get_bd_pins axi_ethernet_0/interrupt] [get_bd_pins interrupt]
connect_bd_net [get_bd_pins axi_ethernet_0/phy_rst_n] [get_bd_pins phy_rst]
connect_bd_net -net processing_system7_0_FCLK_CLK1 [get_bd_pins ref_clk] [get_bd_pins axi_ethernet_0/ref_clk]
connect_bd_net [get_bd_pins axi_ethernet_0_dma/mm2s_introut] [get_bd_pins mm2s_introut]
connect_bd_net [get_bd_pins axi_ethernet_0_dma/s2mm_introut] [get_bd_pins s2mm_introut]
connect_bd_net [get_bd_pins ARESETN] [get_bd_pins axi_mem_intercon/ARESETN]
connect_bd_net -net S00_ARESETN_1 [get_bd_pins proc_sys_reset_1/peripheral_aresetn] \
  [get_bd_pins axi_mem_intercon/S01_ARESETN] [get_bd_pins axi_mem_intercon/S02_ARESETN] \
  [get_bd_pins axi_mem_intercon/S00_ARESETN]
connect_bd_net [get_bd_pins ext_reset_in] [get_bd_pins proc_sys_reset_1/ext_reset_in]

current_bd_instance /jtag
connect_bd_intf_net [get_bd_intf_pins s_axi1] [get_bd_intf_pins axi_jtag_1/s_axi]
connect_bd_intf_net [get_bd_intf_pins s_axi] [get_bd_intf_pins axi_jtag_0/s_axi]
connect_bd_net [get_bd_pins s_axi_aclk] [get_bd_pins axi_jtag_1/s_axi_aclk] [get_bd_pins axi_jtag_0/s_axi_aclk]
connect_bd_net -net proc_sys_reset_0_peripheral_aresetn [get_bd_pins s_axi_aresetn] \
  [get_bd_pins axi_jtag_1/s_axi_aresetn] [get_bd_pins axi_jtag_0/s_axi_aresetn]
connect_bd_net -net ipmc_jtag_TCK_0 [get_bd_pins axi_jtag_0/TCK] [get_bd_pins TCK_0]
connect_bd_net -net ipmc_jtag_TMS_0 [get_bd_pins axi_jtag_0/TMS] [get_bd_pins TMS_0]
connect_bd_net -net ipmc_jtag_TDI_0 [get_bd_pins axi_jtag_0/TDI] [get_bd_pins TDI_0]
connect_bd_net -net TDO_0_0_1 [get_bd_pins TDO_0] [get_bd_pins axi_jtag_0/TDO]
connect_bd_net -net ipmc_jtag_TCK_1 [get_bd_pins axi_jtag_1/TCK] [get_bd_pins TCK_1]
connect_bd_net -net ipmc_jtag_TMS_1 [get_bd_pins axi_jtag_1/TMS] [get_bd_pins TMS_1]
connect_bd_net -net ipmc_jtag_TDI_1 [get_bd_pins axi_jtag_1/TDI] [get_bd_pins TDI_1]
connect_bd_net -net TDO_1_0_1 [get_bd_pins TDO_1] [get_bd_pins axi_jtag_1/TDO]

current_bd_instance /ipmc
connect_bd_intf_net [get_bd_intf_pins S_AXI2] [get_bd_intf_pins ipmc_i2c_0/S_AXI2]
connect_bd_intf_net [get_bd_intf_pins S_AXI] [get_bd_intf_pins ipmc_i2c_0/S_AXI]
connect_bd_intf_net [get_bd_intf_pins S_AXI1] [get_bd_intf_pins ipmc_i2c_1/S_AXI]
connect_bd_intf_net [get_bd_intf_pins S_AXI4] [get_bd_intf_pins ipmc_i2c_1/S_AXI2]
connect_bd_intf_net [get_bd_intf_pins S_AXI3] [get_bd_intf_pins ipmc_i2c_1/S_AXI1]
connect_bd_net [get_bd_pins ipmc_scl_0] [get_bd_pins ipmc_i2c_0/i2c1_scl]
connect_bd_net [get_bd_pins ipmc_sda_0] [get_bd_pins ipmc_i2c_0/i2c1_sda]
connect_bd_net -net ipmc_jtag_irq [get_bd_pins ipmc_i2c_0/irq] [get_bd_pins irq]
connect_bd_net [get_bd_pins s0_i] [get_bd_pins ipmc_i2c_0/s0_i]
connect_bd_net -net s0_i1_1 [get_bd_pins s0_i1] [get_bd_pins ipmc_i2c_0/s0_i1]
connect_bd_net -net ipmc_jtag_s0_o [get_bd_pins ipmc_i2c_0/s0_o] [get_bd_pins s0_o]
connect_bd_net -net ipmc_jtag_s0_o1 [get_bd_pins ipmc_i2c_0/s0_o1] [get_bd_pins s0_o1]
connect_bd_net [get_bd_pins s0_t] [get_bd_pins ipmc_i2c_0/s0_t]
connect_bd_net -net s0_t1_1 [get_bd_pins s0_t1] [get_bd_pins ipmc_i2c_0/s0_t1]
connect_bd_net [get_bd_pins s_axi_aclk] [get_bd_pins ipmc_i2c_1/s_axi_aclk] [get_bd_pins ipmc_i2c_0/s_axi_aclk]
connect_bd_net -net proc_sys_reset_0_peripheral_aresetn [get_bd_pins s_axi_aresetn] \
  [get_bd_pins ipmc_i2c_1/s_axi_aresetn] [get_bd_pins ipmc_i2c_0/s_axi_aresetn]
connect_bd_net [get_bd_pins ipmc_scl_1] [get_bd_pins ipmc_i2c_1/i2c1_scl]
connect_bd_net [get_bd_pins ipmc_sda_1] [get_bd_pins ipmc_i2c_1/i2c1_sda]
connect_bd_net -net ipmc_jtag_iic2intc_irpt [get_bd_pins ipmc_i2c_1/iic2intc_irpt] [get_bd_pins iic2intc_irpt]
connect_bd_net -net ipmc_jtag_irq1 [get_bd_pins ipmc_i2c_1/irq] [get_bd_pins irq1]
connect_bd_net [get_bd_pins ipmc_i2c_0/i2c_addr_received] [get_bd_pins i2c_addr_received]
connect_bd_net [get_bd_pins ipmc_i2c_1/i2c_addr_received] [get_bd_pins i2c_addr_received1]
connect_bd_net [get_bd_pins ha] [get_bd_pins ipmc_i2c_0/ha] [get_bd_pins ipmc_i2c_1/ha]

current_bd_instance /ipmc/ipmc_i2c_0
connect_bd_intf_net [get_bd_intf_pins S_AXI] [get_bd_intf_pins axi_bram_ctrl_0/S_AXI]
connect_bd_intf_net [get_bd_intf_pins S_AXI2] [get_bd_intf_pins axi_gpio_0/S_AXI]
connect_bd_net [get_bd_pins i2c1_sda] [get_bd_pins i2c_switch_1/s]
connect_bd_net [get_bd_pins i2c1_scl] [get_bd_pins i2c_switch_0/s]
connect_bd_net [get_bd_pins axi_bram_ctrl_0/bram_addr_a] [get_bd_pins i2cSlave_0/bram_addr]
connect_bd_net [get_bd_pins axi_bram_ctrl_0/bram_clk_a] [get_bd_pins i2cSlave_0/bram_clk]
connect_bd_net [get_bd_pins axi_bram_ctrl_0/bram_en_a] [get_bd_pins i2cSlave_0/bram_en]
connect_bd_net [get_bd_pins axi_bram_ctrl_0/bram_rst_a] [get_bd_pins i2cSlave_0/bram_rst]
connect_bd_net [get_bd_pins axi_bram_ctrl_0/bram_we_a] [get_bd_pins i2cSlave_0/bram_we]
connect_bd_net [get_bd_pins axi_bram_ctrl_0/bram_wrdata_a] [get_bd_pins i2cSlave_0/bram_wrdata]
connect_bd_net [get_bd_pins axi_gpio_0/gpio_io_o] [get_bd_pins i2c_switch_0/sel] [get_bd_pins i2c_switch_1/sel]
connect_bd_net [get_bd_pins i2cSlave_0/bram_rddata] [get_bd_pins axi_bram_ctrl_0/bram_rddata_a]
connect_bd_net -net i2cSlave_0_int [get_bd_pins i2cSlave_0/irq] [get_bd_pins irq]
connect_bd_net [get_bd_pins i2cSlave_0/sda_out] [get_bd_pins i2c_switch_1/s1_i]
connect_bd_net [get_bd_pins i2cSlave_0/sda_t] [get_bd_pins i2c_switch_1/s1_t]
connect_bd_net [get_bd_pins i2c_switch_0/s0_o] [get_bd_pins s0_o1]
connect_bd_net [get_bd_pins i2c_switch_0/s1_o] [get_bd_pins i2cSlave_0/scl]
connect_bd_net [get_bd_pins i2c_switch_1/s0_o] [get_bd_pins s0_o]
connect_bd_net [get_bd_pins i2c_switch_1/s1_o] [get_bd_pins i2cSlave_0/sda_in]
connect_bd_net -net proc_sys_reset_0_peripheral_aresetn [get_bd_pins s_axi_aresetn] \
  [get_bd_pins axi_bram_ctrl_0/s_axi_aresetn] [get_bd_pins axi_gpio_0/s_axi_aresetn] [get_bd_pins i2cSlave_0/rst]
connect_bd_net -net processing_system7_0_FCLK_CLK0 [get_bd_pins s_axi_aclk] \
  [get_bd_pins axi_bram_ctrl_0/s_axi_aclk] [get_bd_pins axi_gpio_0/s_axi_aclk] [get_bd_pins i2cSlave_0/clk]
connect_bd_net -net s0_i1_1 [get_bd_pins s0_i1] [get_bd_pins i2c_switch_0/s0_i]
connect_bd_net [get_bd_pins s0_i] [get_bd_pins i2c_switch_1/s0_i]
connect_bd_net -net s0_t1_1 [get_bd_pins s0_t1] [get_bd_pins i2c_switch_0/s0_t]
connect_bd_net [get_bd_pins s0_t] [get_bd_pins i2c_switch_1/s0_t]
connect_bd_net [get_bd_pins xlconstant_0/dout] [get_bd_pins i2c_switch_0/s1_i] [get_bd_pins i2c_switch_0/s1_t]
connect_bd_net [get_bd_pins i2cSlave_0/i2c_addr_received] [get_bd_pins i2c_addr_received]
connect_bd_net [get_bd_pins ha] [get_bd_pins i2cSlave_0/hardware_address]

current_bd_instance /ipmc/ipmc_i2c_1
connect_bd_intf_net [get_bd_intf_pins S_AXI] [get_bd_intf_pins axi_bram_ctrl_0/S_AXI]
connect_bd_intf_net [get_bd_intf_pins S_AXI1] [get_bd_intf_pins axi_iic_0/S_AXI]
connect_bd_intf_net [get_bd_intf_pins S_AXI2] [get_bd_intf_pins axi_gpio_0/S_AXI]
connect_bd_net [get_bd_pins i2c1_sda] [get_bd_pins i2c_switch_1/s]
connect_bd_net [get_bd_pins i2c1_scl] [get_bd_pins i2c_switch_0/s]
connect_bd_net [get_bd_pins axi_bram_ctrl_0/bram_addr_a] [get_bd_pins i2cSlave_0/bram_addr]
connect_bd_net [get_bd_pins axi_bram_ctrl_0/bram_clk_a] [get_bd_pins i2cSlave_0/bram_clk]
connect_bd_net [get_bd_pins axi_bram_ctrl_0/bram_en_a] [get_bd_pins i2cSlave_0/bram_en]
connect_bd_net [get_bd_pins axi_bram_ctrl_0/bram_rst_a] [get_bd_pins i2cSlave_0/bram_rst]
connect_bd_net [get_bd_pins axi_bram_ctrl_0/bram_we_a] [get_bd_pins i2cSlave_0/bram_we]
connect_bd_net [get_bd_pins axi_bram_ctrl_0/bram_wrdata_a] [get_bd_pins i2cSlave_0/bram_wrdata]
connect_bd_net [get_bd_pins axi_gpio_0/gpio_io_o] [get_bd_pins i2c_switch_0/sel] [get_bd_pins i2c_switch_1/sel]
connect_bd_net [get_bd_pins axi_iic_0/iic2intc_irpt] [get_bd_pins iic2intc_irpt]
connect_bd_net [get_bd_pins axi_iic_0/scl_o] [get_bd_pins i2c_switch_0/s0_i]
connect_bd_net [get_bd_pins axi_iic_0/scl_t] [get_bd_pins i2c_switch_0/s0_t]
connect_bd_net [get_bd_pins axi_iic_0/sda_o] [get_bd_pins i2c_switch_1/s0_i]
connect_bd_net [get_bd_pins axi_iic_0/sda_t] [get_bd_pins i2c_switch_1/s0_t]
connect_bd_net [get_bd_pins i2cSlave_0/bram_rddata] [get_bd_pins axi_bram_ctrl_0/bram_rddata_a]
connect_bd_net -net i2cSlave_0_int [get_bd_pins i2cSlave_0/irq] [get_bd_pins irq]
connect_bd_net [get_bd_pins i2cSlave_0/sda_out] [get_bd_pins i2c_switch_1/s1_i]
connect_bd_net [get_bd_pins i2cSlave_0/sda_t] [get_bd_pins i2c_switch_1/s1_t]
connect_bd_net [get_bd_pins i2c_switch_0/s0_o] [get_bd_pins axi_iic_0/scl_i]
connect_bd_net [get_bd_pins i2c_switch_0/s1_o] [get_bd_pins i2cSlave_0/scl]
connect_bd_net [get_bd_pins i2c_switch_1/s0_o] [get_bd_pins axi_iic_0/sda_i]
connect_bd_net [get_bd_pins i2c_switch_1/s1_o] [get_bd_pins i2cSlave_0/sda_in]
connect_bd_net -net processing_system7_0_FCLK_CLK0 [get_bd_pins s_axi_aclk] \
  [get_bd_pins axi_bram_ctrl_0/s_axi_aclk] [get_bd_pins axi_gpio_0/s_axi_aclk] [get_bd_pins axi_iic_0/s_axi_aclk] \
  [get_bd_pins i2cSlave_0/clk]
connect_bd_net [get_bd_pins s_axi_aresetn] \
  [get_bd_pins axi_bram_ctrl_0/s_axi_aresetn] [get_bd_pins axi_gpio_0/s_axi_aresetn] [get_bd_pins axi_iic_0/s_axi_aresetn] \
  [get_bd_pins i2cSlave_0/rst]
connect_bd_net [get_bd_pins xlconstant_0/dout] [get_bd_pins i2c_switch_0/s1_i] [get_bd_pins i2c_switch_0/s1_t]
connect_bd_net [get_bd_pins i2cSlave_0/i2c_addr_received] [get_bd_pins i2c_addr_received]
connect_bd_net [get_bd_pins ha] [get_bd_pins i2cSlave_0/hardware_address]

current_bd_instance /cpu
connect_bd_intf_net [get_bd_intf_pins M18_AXI] [get_bd_intf_pins ps7_0_axi_periph/M18_AXI]
connect_bd_intf_net [get_bd_intf_pins M14_AXI] [get_bd_intf_pins ps7_0_axi_periph/M14_AXI]
connect_bd_intf_net [get_bd_intf_pins M13_AXI] [get_bd_intf_pins ps7_0_axi_periph/M13_AXI]
connect_bd_intf_net [get_bd_intf_pins M03_AXI] [get_bd_intf_pins ps7_0_axi_periph/M03_AXI]
connect_bd_intf_net [get_bd_intf_pins M00_AXI] [get_bd_intf_pins ps7_0_axi_periph/M00_AXI]
connect_bd_intf_net [get_bd_intf_pins S_AXI_HP0] [get_bd_intf_pins processing_system7_0/S_AXI_HP0]
connect_bd_intf_net [get_bd_intf_pins M15_AXI] [get_bd_intf_pins ps7_0_axi_periph/M15_AXI]
connect_bd_intf_net [get_bd_intf_pins M17_AXI] [get_bd_intf_pins ps7_0_axi_periph/M17_AXI]
connect_bd_intf_net [get_bd_intf_pins M02_AXI] [get_bd_intf_pins ps7_0_axi_periph/M02_AXI]
connect_bd_intf_net [get_bd_intf_pins FIXED_IO] [get_bd_intf_pins processing_system7_0/FIXED_IO]
connect_bd_intf_net [get_bd_intf_pins DDR] [get_bd_intf_pins processing_system7_0/DDR]
connect_bd_intf_net [get_bd_intf_pins M04_AXI] [get_bd_intf_pins ps7_0_axi_periph/M04_AXI]
connect_bd_intf_net [get_bd_intf_pins M01_AXI] [get_bd_intf_pins ps7_0_axi_periph/M01_AXI]
connect_bd_intf_net [get_bd_intf_pins M05_AXI] [get_bd_intf_pins ps7_0_axi_periph/M05_AXI]
connect_bd_intf_net [get_bd_intf_pins M06_AXI] [get_bd_intf_pins ps7_0_axi_periph/M06_AXI]
connect_bd_intf_net [get_bd_intf_pins M07_AXI] [get_bd_intf_pins ps7_0_axi_periph/M07_AXI]
connect_bd_intf_net [get_bd_intf_pins M08_AXI] [get_bd_intf_pins ps7_0_axi_periph/M08_AXI]
connect_bd_intf_net [get_bd_intf_pins M16_AXI] [get_bd_intf_pins ps7_0_axi_periph/M16_AXI]
connect_bd_intf_net [get_bd_intf_pins M10_AXI] [get_bd_intf_pins ps7_0_axi_periph/M10_AXI]
connect_bd_intf_net [get_bd_intf_pins M09_AXI] [get_bd_intf_pins ps7_0_axi_periph/M09_AXI]
connect_bd_intf_net [get_bd_intf_pins M11_AXI] [get_bd_intf_pins ps7_0_axi_periph/M11_AXI]
connect_bd_intf_net [get_bd_intf_pins M12_AXI] [get_bd_intf_pins ps7_0_axi_periph/M12_AXI]
connect_bd_intf_net [get_bd_intf_pins processing_system7_0/M_AXI_GP0] [get_bd_intf_pins ps7_0_axi_periph/S00_AXI]
connect_bd_net [get_bd_pins xlconstant_0/dout] \
  [get_bd_pins processing_system7_0/SDIO0_CDN] [get_bd_pins processing_system7_0/SDIO0_WP] \
  [get_bd_pins processing_system7_0/SDIO1_CDN] [get_bd_pins processing_system7_0/SDIO1_WP]
connect_bd_net [get_bd_pins xlconcat_0/dout] [get_bd_pins processing_system7_0/IRQ_F2P]
connect_bd_net -net ipmc_jtag_s0_o [get_bd_pins I2C1_SDA_I] [get_bd_pins processing_system7_0/I2C1_SDA_I]
connect_bd_net -net s0_i_1 [get_bd_pins processing_system7_0/I2C1_SDA_O] [get_bd_pins I2C1_SDA_O]
connect_bd_net -net s0_t_1 [get_bd_pins processing_system7_0/I2C1_SDA_T] [get_bd_pins I2C1_SDA_T]
connect_bd_net -net ipmc_jtag_s0_o1 [get_bd_pins I2C1_SCL_I] [get_bd_pins processing_system7_0/I2C1_SCL_I]
connect_bd_net -net s0_i1_1 [get_bd_pins processing_system7_0/I2C1_SCL_O] [get_bd_pins I2C1_SCL_O]
connect_bd_net -net s0_t1_1 [get_bd_pins processing_system7_0/I2C1_SCL_T] [get_bd_pins I2C1_SCL_T]
connect_bd_net [get_bd_pins processing_system7_0/FCLK_CLK0] \
  [get_bd_pins FCLK_CLK0] [get_bd_pins ps7_0_axi_periph/S00_ACLK] [get_bd_pins proc_sys_reset_0/slowest_sync_clk] \
  [get_bd_pins ps7_0_axi_periph/M00_ACLK] [get_bd_pins ps7_0_axi_periph/ACLK] [get_bd_pins ps7_0_axi_periph/M02_ACLK] \
  [get_bd_pins ps7_0_axi_periph/M01_ACLK] [get_bd_pins processing_system7_0/S_AXI_HP0_ACLK] \
  [get_bd_pins processing_system7_0/M_AXI_GP0_ACLK] [get_bd_pins ps7_0_axi_periph/M03_ACLK] \
  [get_bd_pins ps7_0_axi_periph/M04_ACLK] [get_bd_pins ps7_0_axi_periph/M05_ACLK] [get_bd_pins ps7_0_axi_periph/M06_ACLK] \
  [get_bd_pins ps7_0_axi_periph/M07_ACLK] [get_bd_pins ps7_0_axi_periph/M08_ACLK] [get_bd_pins ps7_0_axi_periph/M09_ACLK] \
  [get_bd_pins ps7_0_axi_periph/M10_ACLK] [get_bd_pins ps7_0_axi_periph/M11_ACLK] [get_bd_pins ps7_0_axi_periph/M12_ACLK] \
  [get_bd_pins ps7_0_axi_periph/M13_ACLK] [get_bd_pins ps7_0_axi_periph/M14_ACLK] [get_bd_pins ps7_0_axi_periph/M15_ACLK] \
  [get_bd_pins ps7_0_axi_periph/M16_ACLK] [get_bd_pins ps7_0_axi_periph/M17_ACLK] [get_bd_pins ps7_0_axi_periph/M18_ACLK]
connect_bd_net [get_bd_pins processing_system7_0/FCLK_CLK1] [get_bd_pins FCLK_CLK1]
connect_bd_net [get_bd_pins processing_system7_0/FCLK_CLK2] [get_bd_pins FCLK_CLK2]
connect_bd_net [get_bd_pins processing_system7_0/FCLK_RESET0_N] [get_bd_pins ext_reset_in] [get_bd_pins proc_sys_reset_0/ext_reset_in]
connect_bd_net -net axi_ethernet_0_dma_mm2s_introut [get_bd_pins In0] [get_bd_pins xlconcat_0/In0]
connect_bd_net -net axi_ethernet_0_dma_s2mm_introut [get_bd_pins In1] [get_bd_pins xlconcat_0/In1]
connect_bd_net -net axi_ethernet_0_mac_irq [get_bd_pins In2] [get_bd_pins xlconcat_0/In2]
connect_bd_net -net axi_ethernet_0_interrupt [get_bd_pins In3] [get_bd_pins xlconcat_0/In3]
connect_bd_net -net ipmc_jtag_irq [get_bd_pins In4] [get_bd_pins xlconcat_0/In4]
connect_bd_net -net ipmc_jtag_iic2intc_irpt [get_bd_pins In5] [get_bd_pins xlconcat_0/In5]
connect_bd_net -net ipmc_jtag_irq1 [get_bd_pins In6] [get_bd_pins xlconcat_0/In6]
connect_bd_net -net ARESETN_1 [get_bd_pins proc_sys_reset_0/interconnect_aresetn] [get_bd_pins interconnect_aresetn]
connect_bd_net [get_bd_pins proc_sys_reset_0/peripheral_aresetn] \
  [get_bd_pins S00_ARESETN] [get_bd_pins ps7_0_axi_periph/S00_ARESETN] [get_bd_pins ps7_0_axi_periph/M00_ARESETN] \
  [get_bd_pins ps7_0_axi_periph/ARESETN] [get_bd_pins ps7_0_axi_periph/M02_ARESETN] \
  [get_bd_pins ps7_0_axi_periph/M01_ARESETN] [get_bd_pins ps7_0_axi_periph/M03_ARESETN] \
  [get_bd_pins ps7_0_axi_periph/M04_ARESETN] [get_bd_pins ps7_0_axi_periph/M05_ARESETN] \
  [get_bd_pins ps7_0_axi_periph/M06_ARESETN] [get_bd_pins ps7_0_axi_periph/M07_ARESETN] \
  [get_bd_pins ps7_0_axi_periph/M08_ARESETN] [get_bd_pins ps7_0_axi_periph/M09_ARESETN] \
  [get_bd_pins ps7_0_axi_periph/M10_ARESETN] [get_bd_pins ps7_0_axi_periph/M11_ARESETN] \
  [get_bd_pins ps7_0_axi_periph/M12_ARESETN] [get_bd_pins ps7_0_axi_periph/M13_ARESETN] \
  [get_bd_pins ps7_0_axi_periph/M14_ARESETN] [get_bd_pins ps7_0_axi_periph/M15_ARESETN] \
  [get_bd_pins ps7_0_axi_periph/M16_ARESETN] [get_bd_pins ps7_0_axi_periph/M17_ARESETN] \
  [get_bd_pins ps7_0_axi_periph/M18_ARESETN]
connect_bd_net [get_bd_pins proc_sys_reset_0/peripheral_reset] [get_bd_pins peripheral_reset]
connect_bd_net -net In7_1 [get_bd_pins In7] [get_bd_pins xlconcat_0/In7]
connect_bd_net -net In8_1 [get_bd_pins In8] [get_bd_pins xlconcat_0/In8]
connect_bd_net -net In9_1 [get_bd_pins In9] [get_bd_pins xlconcat_0/In9]
connect_bd_net -net In10_1 [get_bd_pins In10] [get_bd_pins xlconcat_0/In10]
connect_bd_net -net In11_1 [get_bd_pins In11] [get_bd_pins xlconcat_0/In11]
set_property HDL_ATTRIBUTE.BMM_INFO_PROCESSOR {arm > design_1 axi_bram_ctrl_0} [get_bd_cells processing_system7_0]
set_property HDL_ATTRIBUTE.KEEP_HIERARCHY yes [get_bd_cells processing_system7_0]
